# EAGLE schematic MJ838 - rev.1 - TCAN334 - poc (EAGLE 9.6.2)
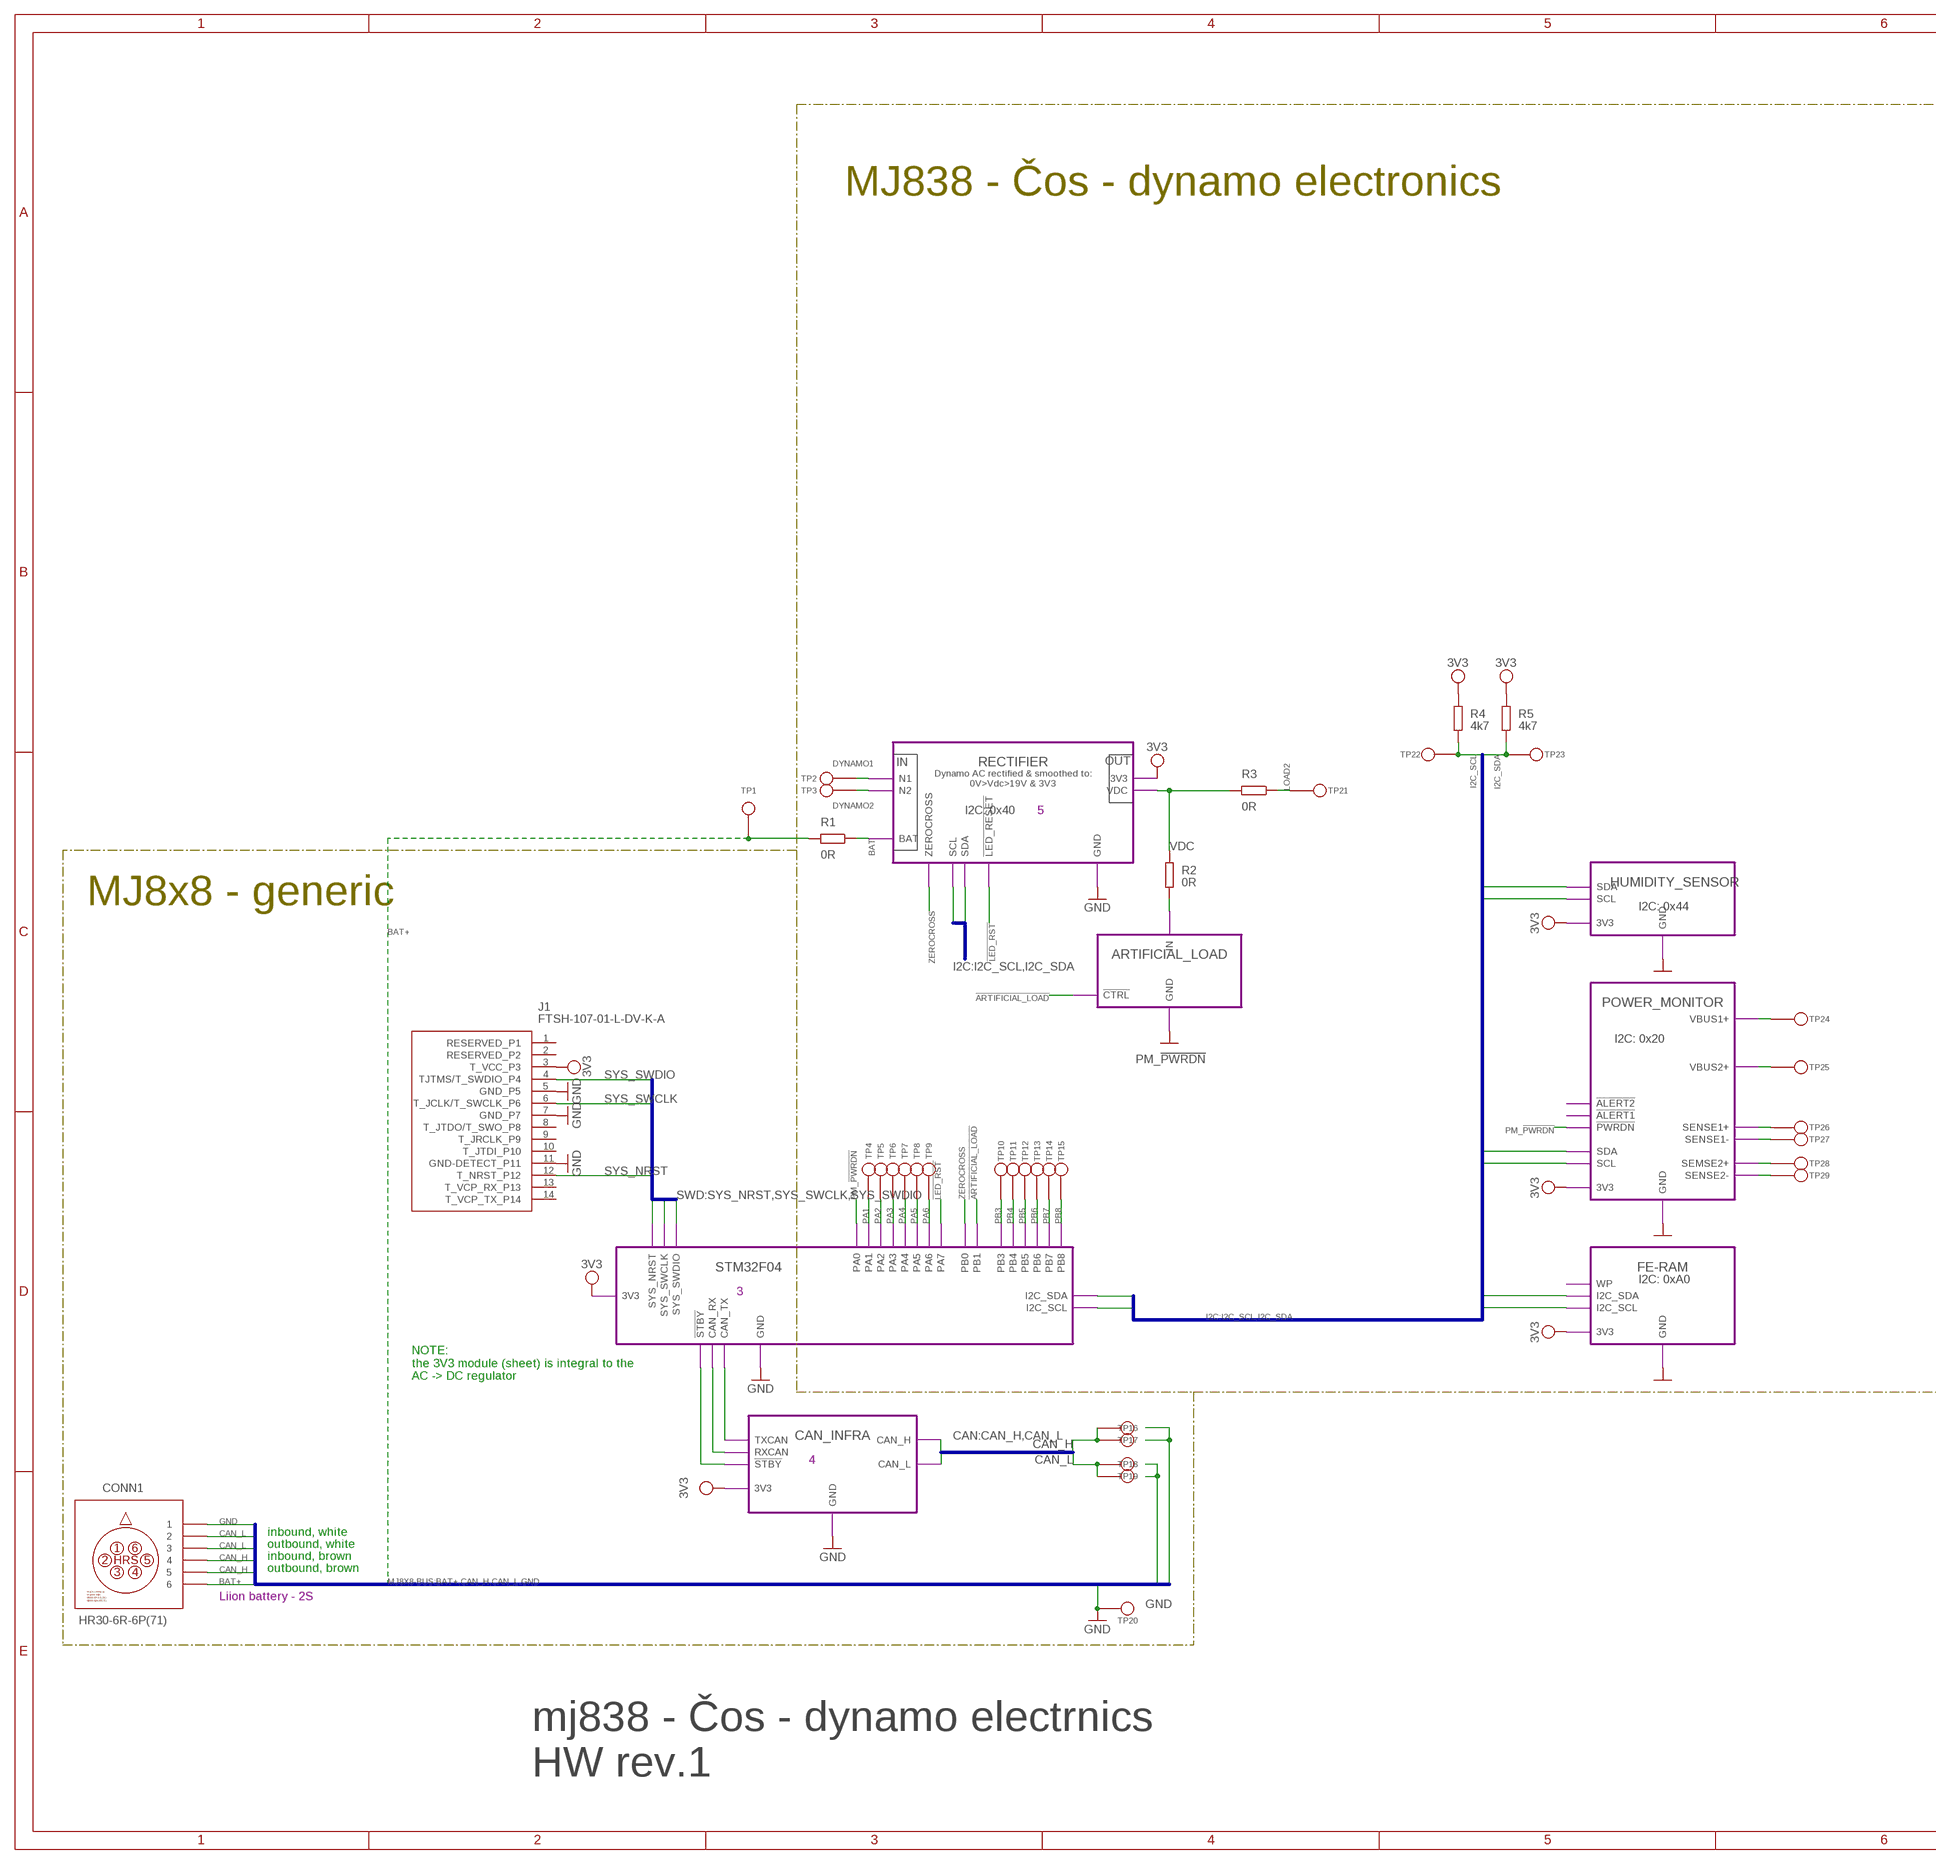
[diagram p0: schematic, sheet 1, part 1 of 2]
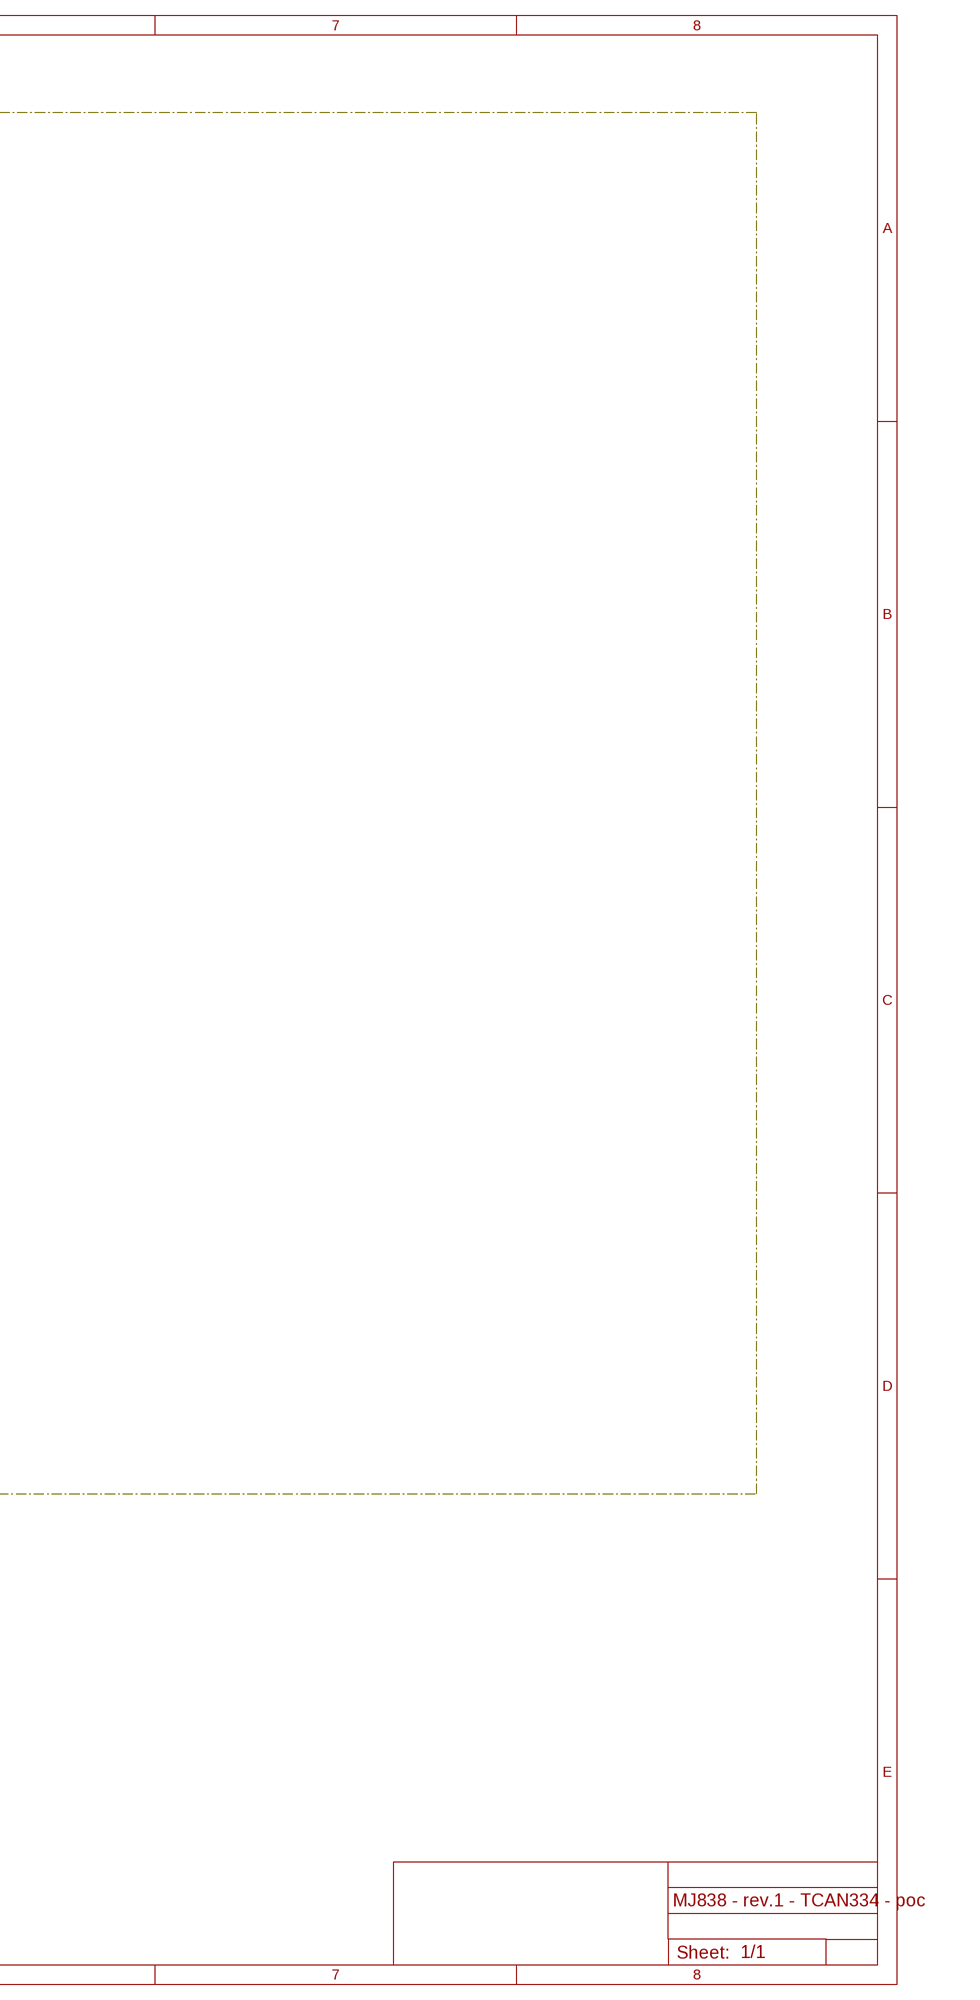
[diagram p1: schematic, sheet 1, part 2 of 2]

## Parts
CONN1  HR30-6R-6P(71)  HR-30-6R-6X  (no package)
J1  FTSH-107-01-L-DV-K-A  [FTSH10701LDVKA]
R1  0R  R-EU_R0805  [R0805]
R2  0R  R-EU_R0805  [R0805]
R3  0R  R-EU_R0805  [R0805]
R4  4k7  R-EU_R0402  [R0402]
R5  4k7  R-EU_R0402  [R0402]
TP1  BAT+  TPTH-0.9  [TH-0.9]
TP2  CAN high  TPTH-0.9  [TH-0.9]
TP3  CAN high  TPTH-0.9  [TH-0.9]
TP4  CAN high  TPTH-0.9  [TH-0.9]
TP5  CAN high  TPTH-0.9  [TH-0.9]
TP6  CAN high  TPTH-0.9  [TH-0.9]
TP7  CAN high  TPTH-0.9  [TH-0.9]
TP8  CAN high  TPTH-0.9  [TH-0.9]
TP9  CAN high  TPTH-0.9  [TH-0.9]
TP10  CAN high  TPTH-0.9  [TH-0.9]
TP11  CAN high  TPTH-0.9  [TH-0.9]
TP12  CAN high  TPTH-0.9  [TH-0.9]
TP13  CAN high  TPTH-0.9  [TH-0.9]
TP14  CAN high  TPTH-0.9  [TH-0.9]
TP15  CAN high  TPTH-0.9  [TH-0.9]
TP16  CAN high  TPTH-0.9  [TH-0.9]
TP17  CAN high  TPTH-0.9  [TH-0.9]
TP18  CAN low  TPTH-0.9  [TH-0.9]
TP19  CAN low  TPTH-0.9  [TH-0.9]
TP20  GND  TPTH-0.9  [TH-0.9]
TP21  CAN high  TPTH-0.9  [TH-0.9]
TP22  CAN high  TPTH-0.9  [TH-0.9]
TP23  CAN high  TPTH-0.9  [TH-0.9]
TP24  CAN high  TPTH-0.9  [TH-0.9]
TP25  CAN high  TPTH-0.9  [TH-0.9]
TP26  CAN high  TPTH-0.9  [TH-0.9]
TP27  CAN high  TPTH-0.9  [TH-0.9]
TP28  CAN high  TPTH-0.9  [TH-0.9]
TP29  CAN high  TPTH-0.9  [TH-0.9]

## Module instances
STM32F04 = STM32 (part numbers offset by 300)
CAN_INFRA = CAN_INFRA (part numbers offset by 400)
RECTIFIER = RECTIFIER (part numbers offset by 500)
ARTIFICIAL_LOAD = ARTIFICIAL_LOAD (part numbers offset by 800)
FE-RAM = FE-RAM (part numbers offset by 700)
POWER_MONITOR = POWER_MONITOR (part numbers offset by 600)
HUMIDITY_SENSOR = HUMIDITY (part numbers offset by 900)

## Nets
3V3 [3V3]: J1.3(T_VCC_P3) R4.2 R5.2 ; port STM32F04.3V3 CAN_INFRA.3V3 RECTIFIER.3V3 FE-RAM.3V3 POWER_MONITOR.3V3 HUMIDITY_SENSOR.3V3
!ARTIFICIAL_LOAD! [signal]: port ARTIFICIAL_LOAD.!CTRL! STM32F04.PB1
!LED_RST! [signal]: port RECTIFIER.!LED_RESET! STM32F04.PA7
!STBY! [signal]: port CAN_INFRA.!STBY! STM32F04.!STBY!
ART_LOAD_IN [VDC]: R2.2 ; port ARTIFICIAL_LOAD.IN
BAT [BAT+]: R1.1 ; port RECTIFIER.BAT
BAT+ [BAT+]: CONN1.6 R1.2 TP1.P$1(TP$1)
CAN_H [signal]: CONN1.4 CONN1.5 TP16.P$1(TP$1) TP17.P$1(TP$1) ; port CAN_INFRA.CAN_H
CAN_L [signal]: CONN1.2 CONN1.3 TP18.P$1(TP$1) TP19.P$1(TP$1) ; port CAN_INFRA.CAN_L
CAN_RX [signal]: port CAN_INFRA.RXCAN STM32F04.CAN_RX
CAN_TX [signal]: port CAN_INFRA.TXCAN STM32F04.CAN_TX
DYNAMO1 [VAC]: TP2.P$1(TP$1) ; port RECTIFIER.N1
DYNAMO2 [VAC]: TP3.P$1(TP$1) ; port RECTIFIER.N2
GND: CONN1.1 J1.5(GND_P5) J1.7(GND_P7) J1.11(GND-DETECT_P11) TP20.P$1(TP$1) ; port STM32F04.GND CAN_INFRA.GND RECTIFIER.GND ARTIFICIAL_LOAD.GND FE-RAM.GND POWER_MONITOR.GND HUMIDITY_SENSOR.GND
I2C_SCL [signal]: R4.1 TP22.P$1(TP$1) ; port FE-RAM.I2C_SCL STM32F04.I2C_SCL POWER_MONITOR.SCL HUMIDITY_SENSOR.SCL RECTIFIER.SCL
I2C_SDA [signal]: R5.1 TP23.P$1(TP$1) ; port FE-RAM.I2C_SDA STM32F04.I2C_SDA POWER_MONITOR.SDA HUMIDITY_SENSOR.SDA RECTIFIER.SDA
LOAD2 [VDC]: R3.1 TP21.P$1(TP$1)
PA1 [signal]: TP4.P$1(TP$1) ; port STM32F04.PA1
PA2 [signal]: TP5.P$1(TP$1) ; port STM32F04.PA2
PA3 [signal]: TP6.P$1(TP$1) ; port STM32F04.PA3
PA4 [signal]: TP7.P$1(TP$1) ; port STM32F04.PA4
PA5 [signal]: TP8.P$1(TP$1) ; port STM32F04.PA5
PA6 [signal]: TP9.P$1(TP$1) ; port STM32F04.PA6
PB3 [signal]: TP10.P$1(TP$1) ; port STM32F04.PB3
PB4 [signal]: TP11.P$1(TP$1) ; port STM32F04.PB4
PB5 [signal]: TP12.P$1(TP$1) ; port STM32F04.PB5
PB6 [signal]: TP13.P$1(TP$1) ; port STM32F04.PB6
PB7 [signal]: TP14.P$1(TP$1) ; port STM32F04.PB7
PB8 [signal]: TP15.P$1(TP$1) ; port STM32F04.PB8
PM_!PWRDN! [signal]: port STM32F04.PA0 POWER_MONITOR.!PWRDN!
SENSE1+ [VDC]: TP26.P$1(TP$1) ; port POWER_MONITOR.SENSE1+
SENSE1- [VDC]: TP27.P$1(TP$1) ; port POWER_MONITOR.SENSE1-
SENSE2+ [VDC]: TP28.P$1(TP$1) ; port POWER_MONITOR.SEMSE2+
SENSE2- [VDC]: TP29.P$1(TP$1) ; port POWER_MONITOR.SENSE2-
SYS_NRST [signal]: J1.12(T_NRST_P12) ; port STM32F04.SYS_NRST
SYS_SWCLK [signal]: J1.6(T_JCLK/T_SWCLK_P6) ; port STM32F04.SYS_SWCLK
SYS_SWDIO [signal]: J1.4(TJTMS/T_SWDIO_P4) ; port STM32F04.SYS_SWDIO
VBUS1+ [VDC]: TP24.P$1(TP$1) ; port POWER_MONITOR.VBUS1+
VBUS2+ [VDC]: TP25.P$1(TP$1) ; port POWER_MONITOR.VBUS2+
VDC [VDC]: R2.1 R3.2 ; port RECTIFIER.VDC
ZEROCROSS [signal]: port STM32F04.PB0 RECTIFIER.ZEROCROSS
Unconnected: J1.1(RESERVED_P1) J1.2(RESERVED_P2) J1.8(T_JTDO/T_SWO_P8) J1.9(T_JRCLK_P9) J1.10(T_JTDI_P10) J1.13(T_VCP_RX_P13) J1.14(T_VCP_TX_P14)

## Buses
CAN:CAN_H,CAN_L
SWD:SYS_NRST,SYS_SWCLK,SYS_SWDIO
MJ8X8-BUS:BAT+,CAN_H,CAN_L,GND
I2C:I2C_SCL,I2C_SDA

## Notes on the sheet
- MJ838 - Čos - dynamo electronics
- IN | OUT
- Dynamo AC rectified & smoothed to:
  0V>Vdc>19V & 3V3
- I2C: 0x40 | 5
- MJ8x8 - generic
- I2C: 0x44
- I2C: 0x20
- I2C: 0xA0
- 3
- NOTE:
  the 3V3 module (sheet) is integral to the
  AC -> DC regulator
- 4
- inbound, white
- outbound, white
- inbound, brown
- outbound, brown
- Liion battery - 2S
- mj838 - Čos - dynamo electrnics
  HW rev.1

## Library data of the parts
CONN1 = HR30-6R-6P - PushPull Receptacle:HR-30-6R-6X
J1 = STM32 JTAG 1.27mm 14pin header:FTSH-107-01-L-DV-K-A: Headers & Wire Housings .050" Micro Terminal Strip Source: Datasheet <https://componentsearchengine.com/Datasheets/1/FTSH-107-01-L-DV-K-A.pdf>; DESCRIPTION: Headers & Wire Housings .050" Micro Terminal Strip; HEIGHT: 5.97mm; MANUFACTURER_NAME: SAMTEC; MANUFACTURER_PART_NUMBER: FTSH-107-01-L-DV-K-A; MOUSER_PART_NUMBER: 200-FTSH10701LDVKA; MOUSER_PRICE-STOCK: https://www.mouser.com/Search/Refine.aspx?Keyword=200-FTSH10701LDVKA
R1-R5 = rcl:R-EU_: RESISTOR, European symbol; SPICEPREFIX: R
TP1-TP29 = signal testpoint:TP

## Module STM32
Ports: GND(pwr) 3V3(pwr) SYS_NRST(in) SYS_SWCLK(io) SYS_SWDIO(io) CAN_RX(in) CAN_TX(out) !STBY!(out) I2C_SCL(out) I2C_SDA(io) PB1(out) PB3(io) PB4(io) PB5(io) PB6(io) PB7(io) PB8(io) PB0(in) PA0(out) PA1(io) PA7(out) PA2(io) PA3(io) PA4(io) PA5(io) PA6(io)
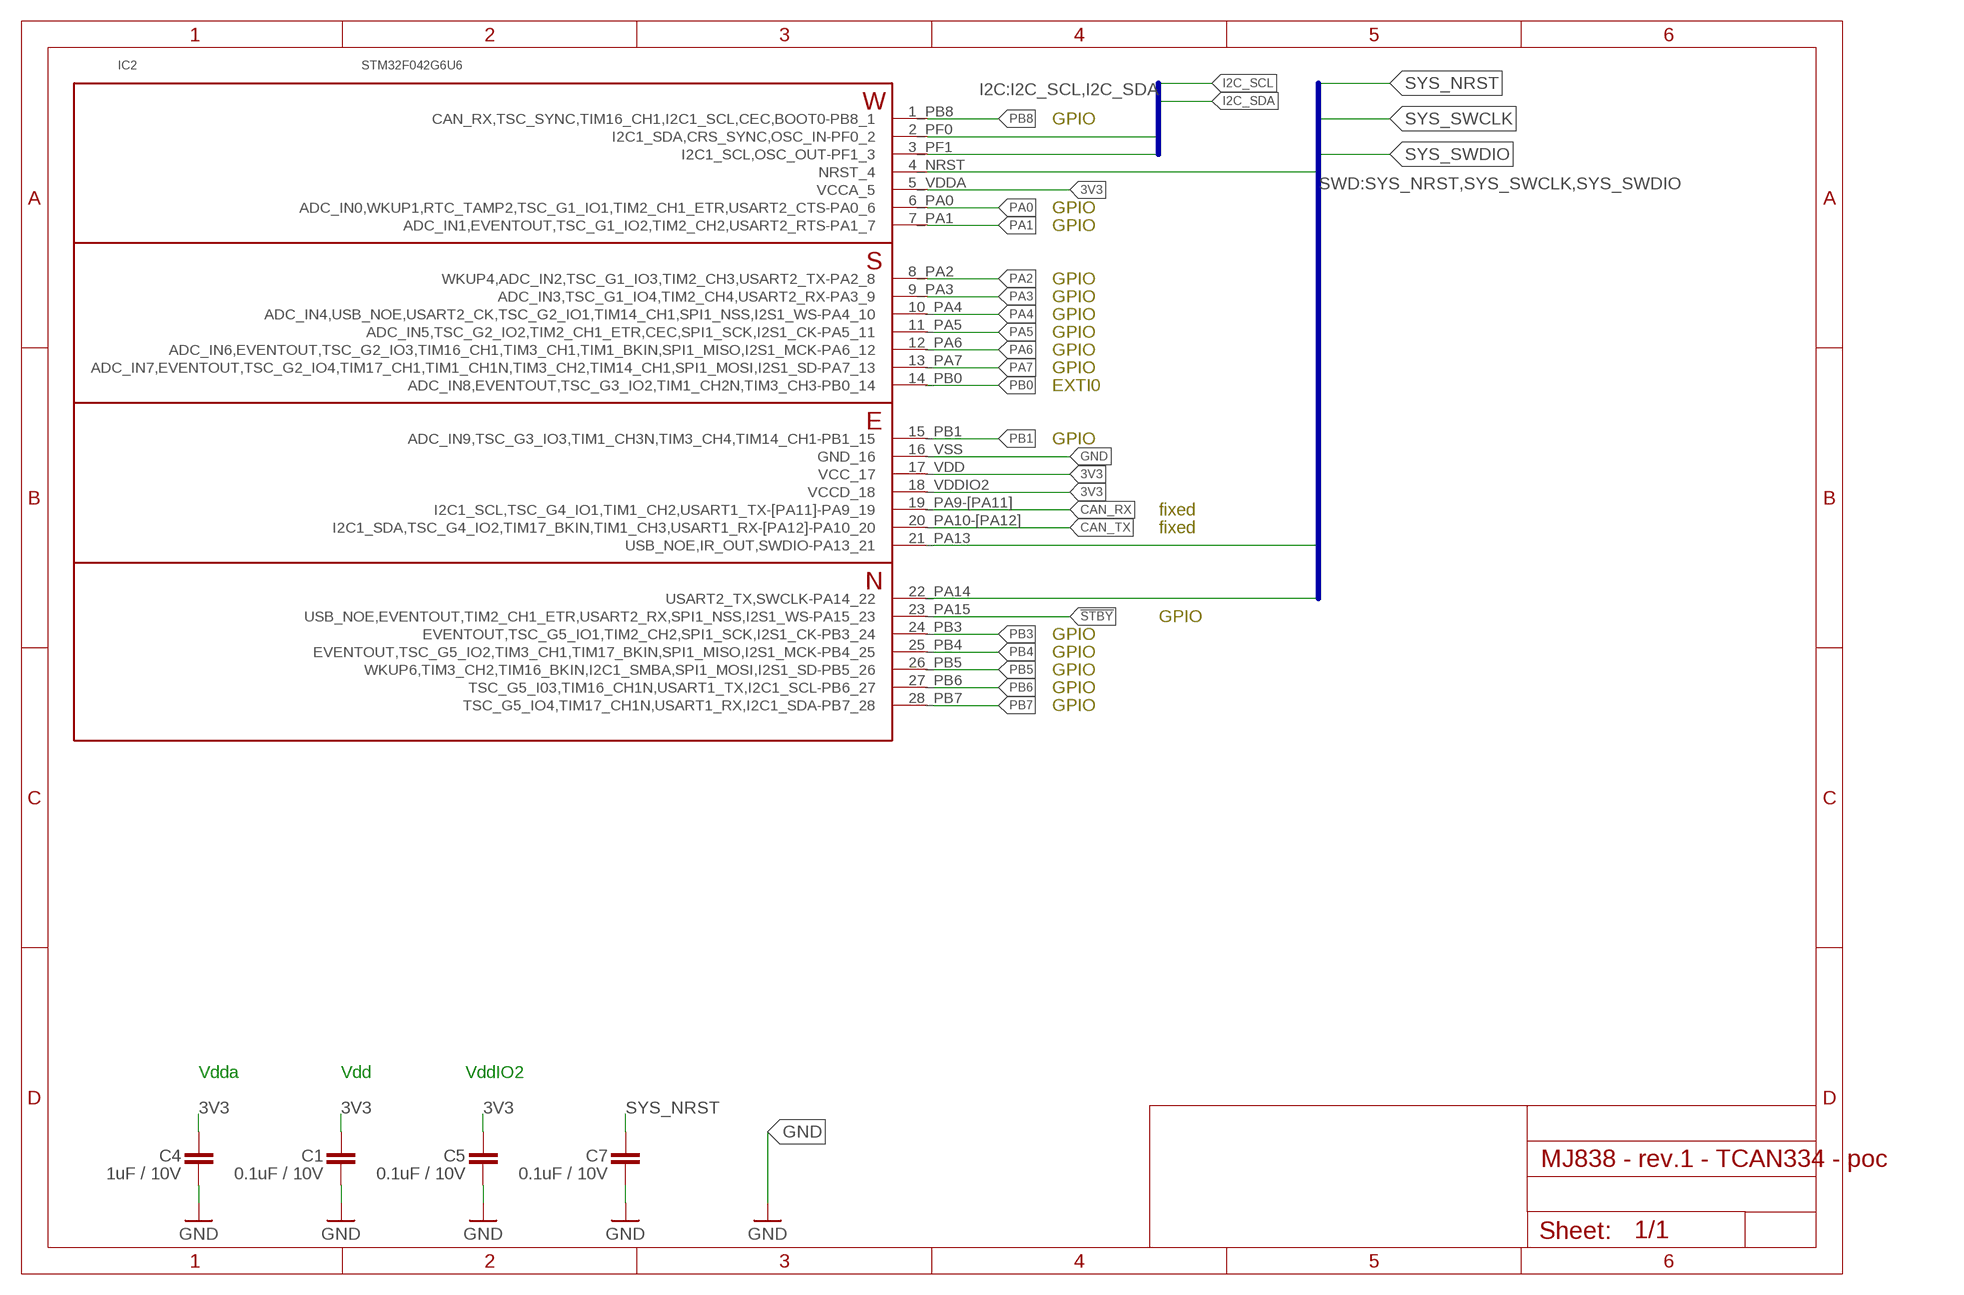
[diagram p2: schematic, module STM32, sheet 1]

### Parts
C1  0.1uF / 10V  C-EUC0402  [C0402]
C4  1uF / 10V  C-EUC0402  [C0402]
C5  0.1uF / 10V  C-EUC0402  [C0402]
C7  0.1uF / 10V  C-EUC0402  [C0402]
IC2  STM32F042G6U6  STM32F042G6  [UFQFPN-28]

### Nets
3V3 [3V3]: C1.2 C4.2 C5.2 IC2.5_VDDA(VCCA_5) IC2.17_VDD(VCC_17) IC2.18_VDDIO2(VCCD_18)
!STBY! [signal]: IC2.23_PA15(USB_NOE,EVENTOUT,TIM2_CH1_ETR,USART2_RX,SPI1_NSS,I2S1_WS-PA15_23)
CAN_RX [signal]: IC2.19_PA9-[PA11](I2C1_SCL,TSC_G4_IO1,TIM1_CH2,USART1_TX-[PA11]-PA9_19)
CAN_TX [signal]: IC2.20_PA10-[PA12](I2C1_SDA,TSC_G4_IO2,TIM17_BKIN,TIM1_CH3,USART1_RX-[PA12]-PA10_20)
GND: C1.1 C4.1 C5.1 C7.1 IC2.16_VSS(GND_16)
I2C_SCL [signal]: IC2.3_PF1(I2C1_SCL,OSC_OUT-PF1_3)
I2C_SDA [signal]: IC2.2_PF0(I2C1_SDA,CRS_SYNC,OSC_IN-PF0_2)
PA0 [signal]: IC2.6_PA0(ADC_IN0,WKUP1,RTC_TAMP2,TSC_G1_IO1,TIM2_CH1_ETR,USART2_CTS-PA0_6)
PA1 [signal]: IC2.7_PA1(ADC_IN1,EVENTOUT,TSC_G1_IO2,TIM2_CH2,USART2_RTS-PA1_7)
PA2 [signal]: IC2.8_PA2(WKUP4,ADC_IN2,TSC_G1_IO3,TIM2_CH3,USART2_TX-PA2_8)
PA3 [signal]: IC2.9_PA3(ADC_IN3,TSC_G1_IO4,TIM2_CH4,USART2_RX-PA3_9)
PA4 [signal]: IC2.10_PA4(ADC_IN4,USB_NOE,USART2_CK,TSC_G2_IO1,TIM14_CH1,SPI1_NSS,I2S1_WS-PA4_10)
PA5 [signal]: IC2.11_PA5(ADC_IN5,TSC_G2_IO2,TIM2_CH1_ETR,CEC,SPI1_SCK,I2S1_CK-PA5_11)
PA6 [signal]: IC2.12_PA6(ADC_IN6,EVENTOUT,TSC_G2_IO3,TIM16_CH1,TIM3_CH1,TIM1_BKIN,SPI1_MISO,I2S1_MCK-PA6_12)
PA7 [signal]: IC2.13_PA7(ADC_IN7,EVENTOUT,TSC_G2_IO4,TIM17_CH1,TIM1_CH1N,TIM3_CH2,TIM14_CH1,SPI1_MOSI,I2S1_SD-PA7_13)
PB0 [signal]: IC2.14_PB0(ADC_IN8,EVENTOUT,TSC_G3_IO2,TIM1_CH2N,TIM3_CH3-PB0_14)
PB1 [signal]: IC2.15_PB1(ADC_IN9,TSC_G3_IO3,TIM1_CH3N,TIM3_CH4,TIM14_CH1-PB1_15)
PB3 [signal]: IC2.24_PB3(EVENTOUT,TSC_G5_IO1,TIM2_CH2,SPI1_SCK,I2S1_CK-PB3_24)
PB4 [signal]: IC2.25_PB4(EVENTOUT,TSC_G5_IO2,TIM3_CH1,TIM17_BKIN,SPI1_MISO,I2S1_MCK-PB4_25)
PB5 [signal]: IC2.26_PB5(WKUP6,TIM3_CH2,TIM16_BKIN,I2C1_SMBA,SPI1_MOSI,I2S1_SD-PB5_26)
PB6 [signal]: IC2.27_PB6(TSC_G5_I03,TIM16_CH1N,USART1_TX,I2C1_SCL-PB6_27)
PB7 [signal]: IC2.28_PB7(TSC_G5_IO4,TIM17_CH1N,USART1_RX,I2C1_SDA-PB7_28)
PB8 [signal]: IC2.1_PB8(CAN_RX,TSC_SYNC,TIM16_CH1,I2C1_SCL,CEC,BOOT0-PB8_1)
SYS_NRST [signal]: C7.2 IC2.4_NRST(NRST_4)
SYS_SWCLK [signal]: IC2.22_PA14(USART2_TX,SWCLK-PA14_22)
SYS_SWDIO [signal]: IC2.21_PA13(USB_NOE,IR_OUT,SWDIO-PA13_21)

### Buses
SWD:SYS_NRST,SYS_SWCLK,SYS_SWDIO
I2C:I2C_SCL,I2C_SDA

### Notes on the sheet
- GPIO
- GPIO
- GPIO
- GPIO
- GPIO
- GPIO
- GPIO
- GPIO
- GPIO
- EXTI0
- GPIO
- fixed
- fixed
- GPIO
- GPIO
- GPIO
- GPIO
- GPIO
- GPIO
- Vdda | Vdd | VddIO2

### Library data of the parts
C1 C4 C5 C7 = rcl:C-EU: CAPACITOR, European symbol; SPICEPREFIX: C
IC2 = STM32F042G6:STM32F042G6

## Module CAN_INFRA
Ports: GND(pwr) 3V3(pwr) CAN_H(io) CAN_L(io) TXCAN(in) RXCAN(out) !STBY!(in)
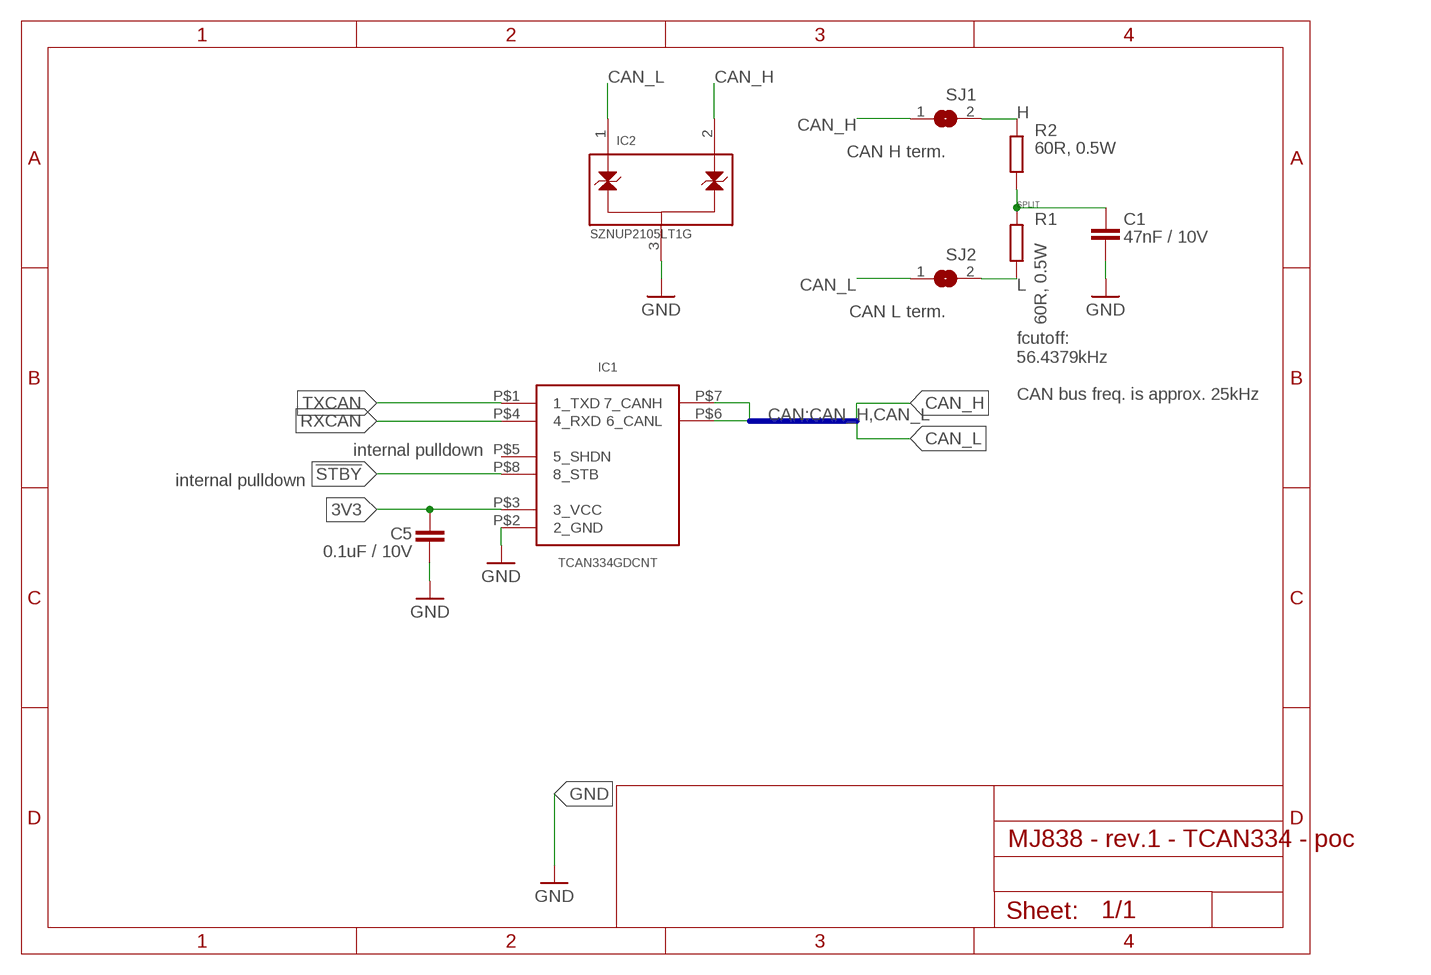
[diagram p3: schematic, module CAN_INFRA, sheet 1]

### Parts
C1  47nF / 10V  C-EUC0402  [C0402]
C5  0.1uF / 10V  C-EUC0402  [C0402]
IC1  TCAN334GDCNT  CAN33X  [SOT23-8]
IC2  SZNUP2105LT1G  NUP2105L  [SOT-23-3]
R1  60R, 0.5W  R-EU_R0805  [R0805]
R2  60R, 0.5W  R-EU_R0805  [R0805]
SJ1  CAN H term.  SJ  [SJ]
SJ2  CAN L term.  SJ  [SJ]

### Nets
3V3 [3V3]: C5.1 IC1.P$3(3_VCC)
!STBY! [signal]: IC1.P$8(8_STB)
CAN_H [signal]: IC1.P$7(7_CANH) IC2.2(PIN2) SJ1.1
CAN_L [signal]: IC1.P$6(6_CANL) IC2.1(PIN1) SJ2.1
GND: C1.2 C5.2 IC1.P$2(2_GND) IC2.3(PIN3)
H [signal]: R2.2 SJ1.2
L [signal]: R1.1 SJ2.2
RXCAN [signal]: IC1.P$4(4_RXD)
SPLIT [signal]: C1.1 R1.2 R2.1
TXCAN [signal]: IC1.P$1(1_TXD)
Unconnected: IC1.P$5(5_SHDN)

### Buses
CAN:CAN_H,CAN_L

### Notes on the sheet
- fcutoff:
  56.4379kHz
  
  CAN bus freq. is approx. 25kHz
- internal pulldown
- internal pulldown

### Library data of the parts
C1 C5 = rcl:C-EU: CAPACITOR, European symbol; SPICEPREFIX: C
IC1 = TCAN33x - 3.3V CAN Transciever:CAN33X
IC2 = NUP2105L - 27V ESD Protection Diode:NUP2105L
R1 R2 = rcl:R-EU_: RESISTOR, European symbol; SPICEPREFIX: R
SJ1 SJ2 = jumper:SJ: SMD solder JUMPER

## Module ZERO-CROSS_DETECTOR
Ports: GND(pwr) AC-IN(in) OUT(out) 3V3(pwr)
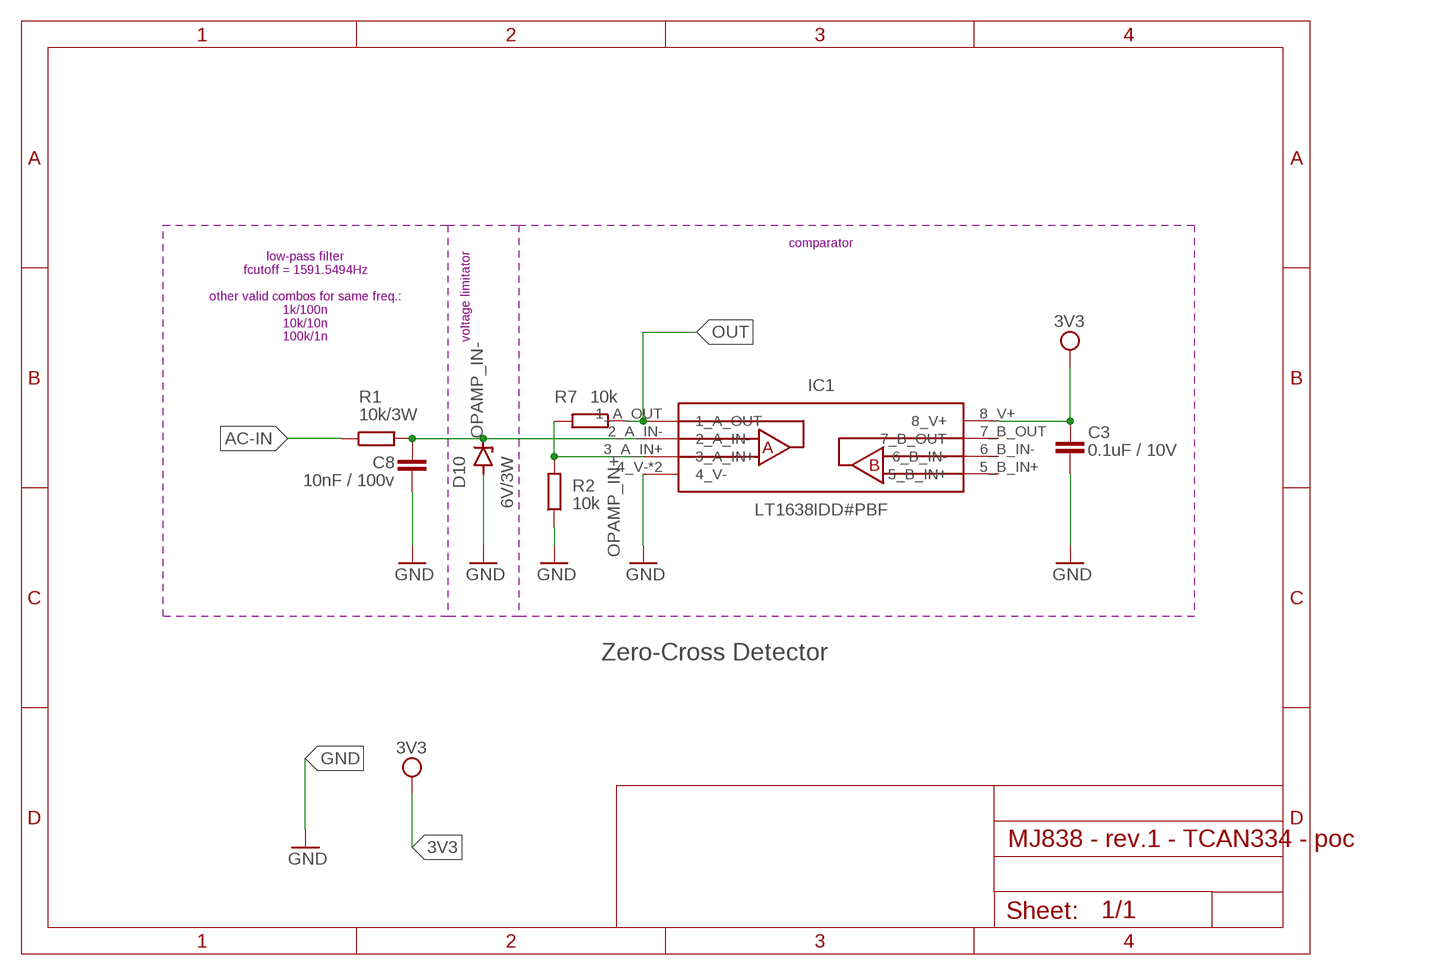
[diagram p4: schematic, module ZERO-CROSS_DETECTOR, sheet 1]

### Parts
C3  0.1uF / 10V  C-EUC0402  [C0402]
C8  10nF / 100v  C-EUC1812  [C1812]
D10  6V/3W  ZENER-DIODEDO214AA  [DO214AA]
IC1  LT1638IDD#PBF  LT1638  [DFN-8]
R1  10k/3W  R-EU_R2512  [R2512]
R2  10k  R-EU_R0402  [R0402]
R7  10k  R-EU_R0402  [R0402]

### Nets
3V3 [3V3]: C3.2 IC1.8_V+
AC-IN [VDynamo]: R1.1
GND: C3.1 C8.1 D10.A IC1.4_V- IC1.9_V-(4_V-) R2.1
OPAMP_IN+ [signal]: IC1.3_A_IN+ R2.2 R7.2
OPAMP_IN- [VDynamo]: C8.2 D10.C IC1.2_A_IN- R1.2
OUT [signal]: IC1.1_A_OUT R7.1
Unconnected: IC1.5_B_IN+ IC1.6_B_IN- IC1.7_B_OUT

### Notes on the sheet
- comparator
- low-pass filter
  fcutoff = 1591.5494Hz
  
  other valid combos for same freq.:
  1k/100n
  10k/10n
  100k/1n
- voltage limitator
- Zero-Cross Detector

### Library data of the parts
C3 C8 = rcl:C-EU: CAPACITOR, European symbol; SPICEPREFIX: C
D10 = diode:ZENER-DIODE: Z-Diode
IC1 = LT1638 - Rail to Rail OpAmp:LT1638
R1 R2 R7 = rcl:R-EU_: RESISTOR, European symbol; SPICEPREFIX: R

## Module 3V3
Ports: GND(pwr) VIN(pwr) 3V3(pwr)
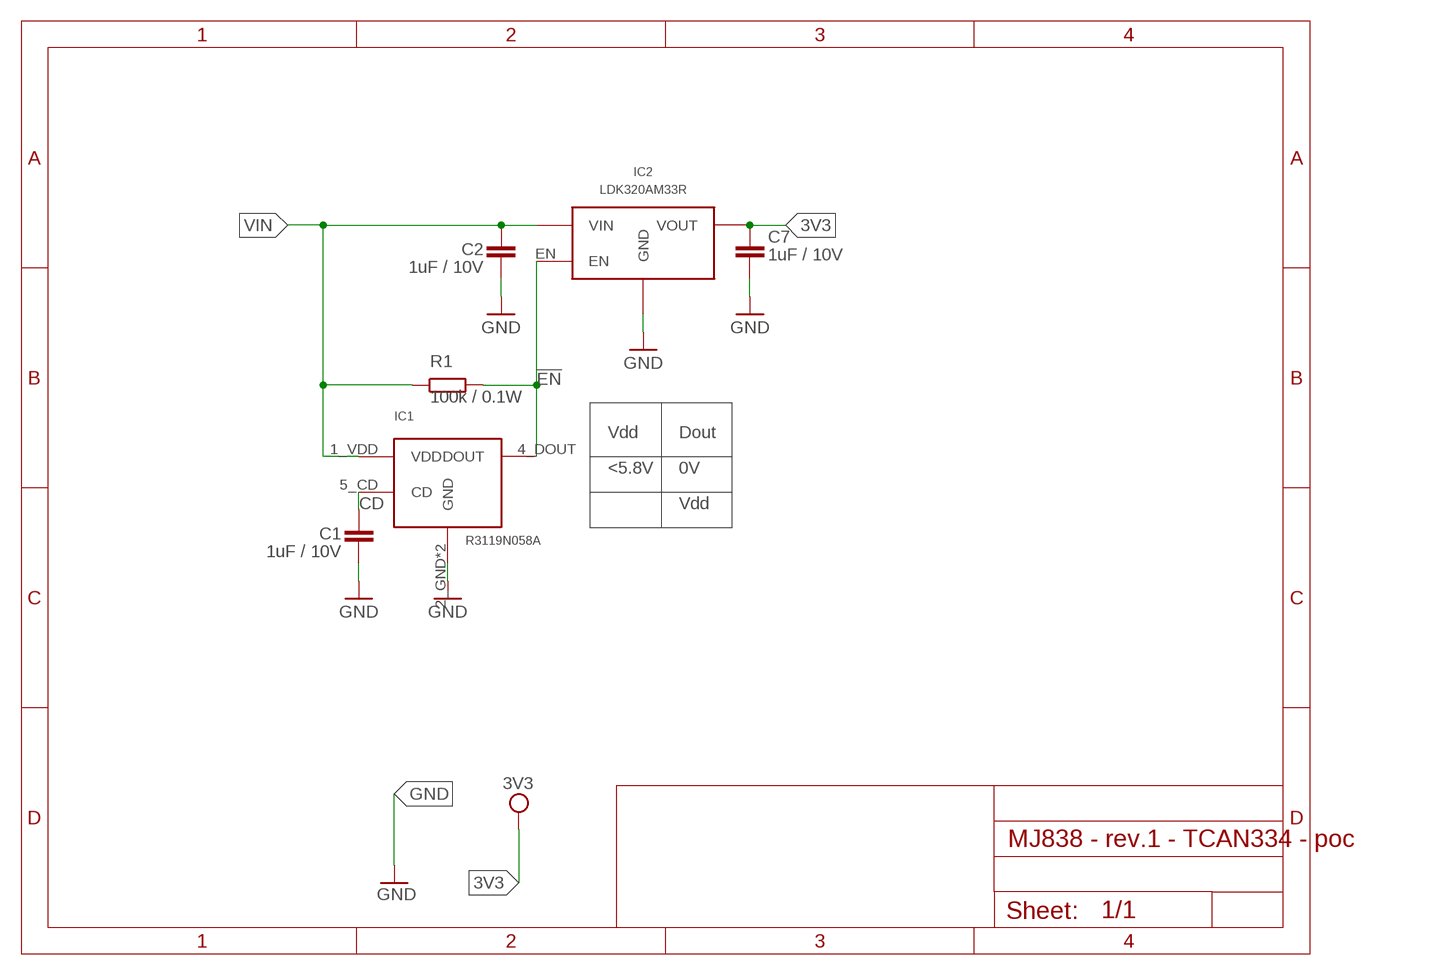
[diagram p5: schematic, module 3V3, sheet 1]

### Parts
C1  1uF / 10V  C-EUC0402  [C0402]
C2  1uF / 10V  C-EUC0402  [C0402]
C7  1uF / 10V  C-EUC0402  [C0402]
IC1  R3119N058A  R3119XXXA  [SOT23-5]
IC2  LDK320AM33R  LDK320SOT-23-5L  [SOT-23-5L]
R1  100k / 0.1W  R-EU_R0402  [R0402]

### Nets
3V3 [3V3]: C7.2 IC2.OUT(VOUT)
!EN! [VDC]: IC1.4_DOUT(DOUT) IC2.EN R1.2
CD [3V3]: C1.1 IC1.5_CD(CD)
GND: C1.2 C2.2 C7.1 IC1.2_GND(GND) IC1.3_GND(GND) IC2.GND
VIN [VDC]: C2.1 IC1.1_VDD(VDD) IC2.IN(VIN) R1.1

### Notes on the sheet
- Vdd | Dout
- <5.8V | 0V
- Vdd

### Library data of the parts
C1 C2 C7 = rcl:C-EU: CAPACITOR, European symbol; SPICEPREFIX: C
IC1 = R3119x - Input Voltage Detector:R3119XXXA
IC2 = LDK320 5V LDO:LDK320
R1 = rcl:R-EU_: RESISTOR, European symbol; SPICEPREFIX: R

## Module SMOOTHING_CAP
Ports: GND(pwr) VIN(pwr) VOUT(pwr)
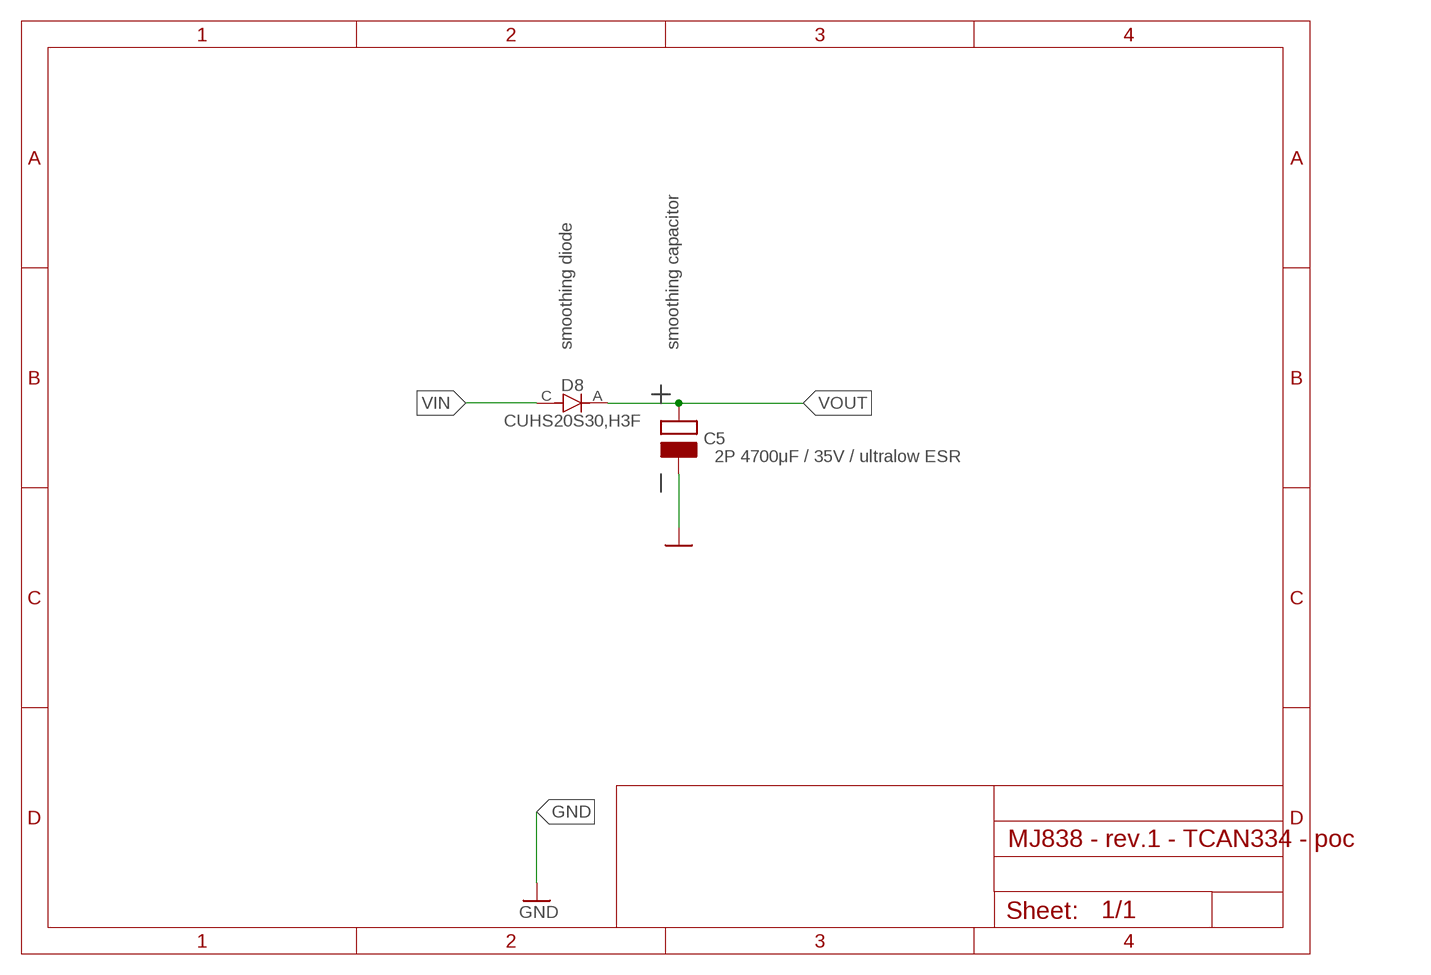
[diagram p6: schematic, module SMOOTHING_CAP, sheet 1]

### Parts
C5  2P 4700μF / 35V / ultralow ESR  C-POL  [TH]
D8  CUHS20S30,H3F  CUHS20S30  [US2H]

### Nets
GND: C5.NEG
VIN [VAC]: D8.C
VOUT [VDC]: C5.POS D8.A

### Notes on the sheet
- smoothing diode | smoothing capacitor

### Library data of the parts
C5 = C-Pol:C-POL
D8 = CUHS20S30 - Schottky Barrier Diode:CUHS20S30

## Module SSR_NC/NO
Ports: SSR_ANODE(pwr) SW1_IN(hiz) SW2_IN(hiz) SW1_OUT(hiz) SW2_OUT(hiz) SW1_CAT(in) SW2_CAT(in)
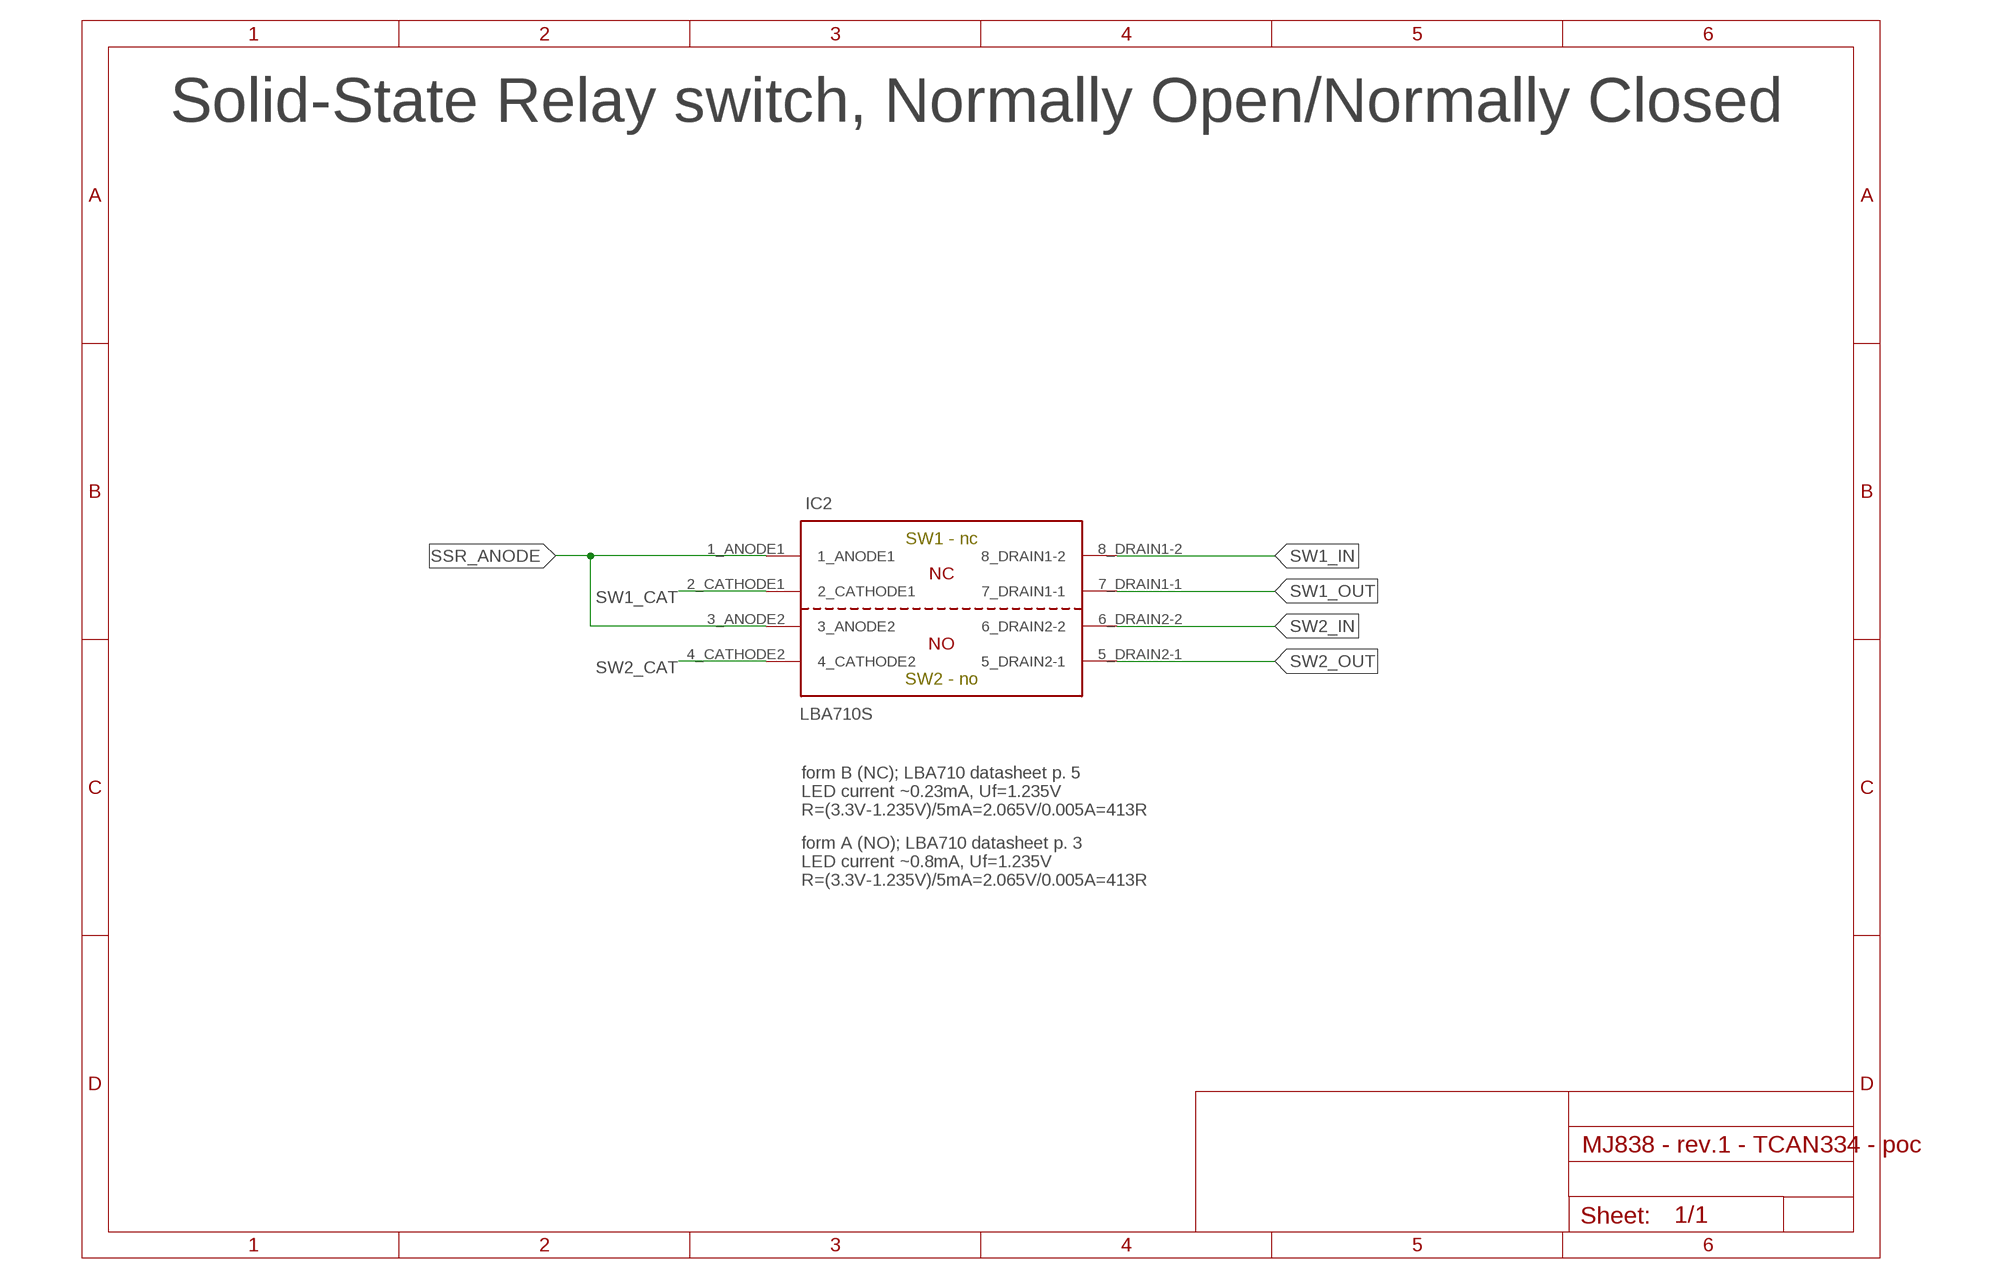
[diagram p7: schematic, module SSR_NC/NO, sheet 1]

### Parts
IC2  LBA710S  LBA710  [SMD_DIP8]

### Nets
SSR_ANODE [3V3]: IC2.1_ANODE1 IC2.3_ANODE2
SW1_CAT [3V3]: IC2.2_CATHODE1
SW1_IN [BAT+]: IC2.8_DRAIN1-2
SW1_OUT [BAT+]: IC2.7_DRAIN1-1
SW2_CAT [3V3]: IC2.4_CATHODE2
SW2_IN [BAT+]: IC2.6_DRAIN2-2
SW2_OUT [BAT+]: IC2.5_DRAIN2-1

### Notes on the sheet
- Solid-State Relay switch, Normally Open/Normally Closed
- SW1 - nc
- SW2 - no
- form B (NC); LBA710 datasheet p. 5
  LED current ~0.23mA, Uf=1.235V
  R=(3.3V-1.235V)/5mA=2.065V/0.005A=413R
- form A (NO); LBA710 datasheet p. 3
  LED current ~0.8mA, Uf=1.235V
  R=(3.3V-1.235V)/5mA=2.065V/0.005A=413R

### Library data of the parts
IC2 = LxA710 - Solid State Relay Form A-AB:LBA710

## Module SSR_NO/NO
Ports: SSR_ANODE(pwr) SW1_IN(hiz) SW1_OUT(hiz) SW2_IN(hiz) SW2_OUT(hiz) SW1_CAT(in) SW2_CAT(in)
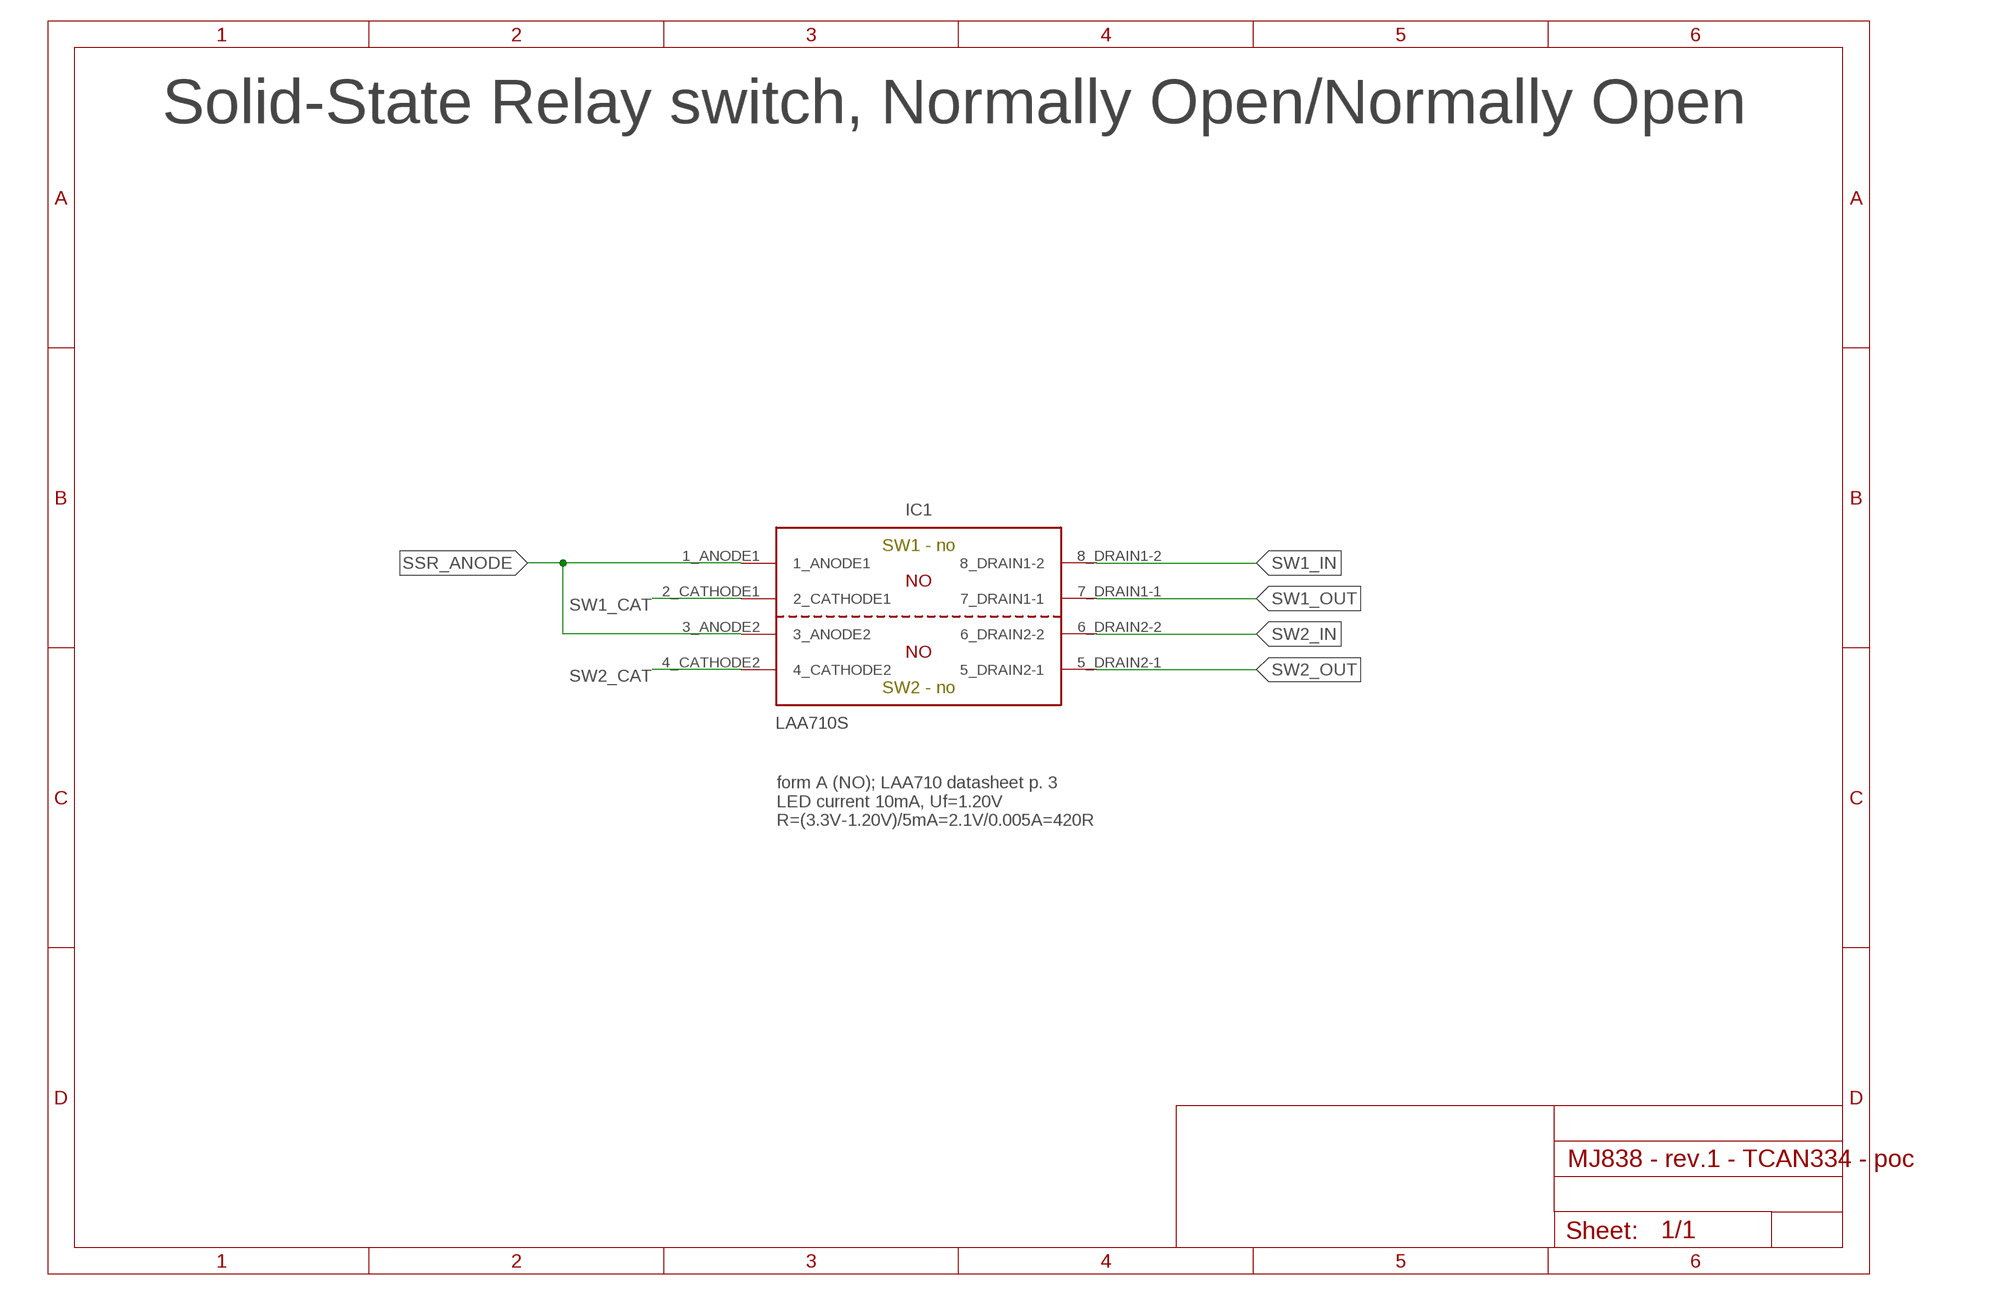
[diagram p8: schematic, module SSR_NO/NO, sheet 1]

### Parts
IC1  LAA710S  LAA710  [SMD_DIP8]

### Nets
SSR_ANODE [3V3]: IC1.1_ANODE1 IC1.3_ANODE2
SW1_CAT [3V3]: IC1.2_CATHODE1
SW1_IN [BAT+]: IC1.8_DRAIN1-2
SW1_OUT [BAT+]: IC1.7_DRAIN1-1
SW2_CAT [3V3]: IC1.4_CATHODE2
SW2_IN [BAT+]: IC1.6_DRAIN2-2
SW2_OUT [BAT+]: IC1.5_DRAIN2-1

### Notes on the sheet
- Solid-State Relay switch, Normally Open/Normally Open
- SW1 - no
- SW2 - no
- form A (NO); LAA710 datasheet p. 3
  LED current 10mA, Uf=1.20V
  R=(3.3V-1.20V)/5mA=2.1V/0.005A=420R

### Library data of the parts
IC1 = LxA710 - Solid State Relay Form A-AB:LAA710

## Module OVP
Ports: N1(pwr) N2(pwr)
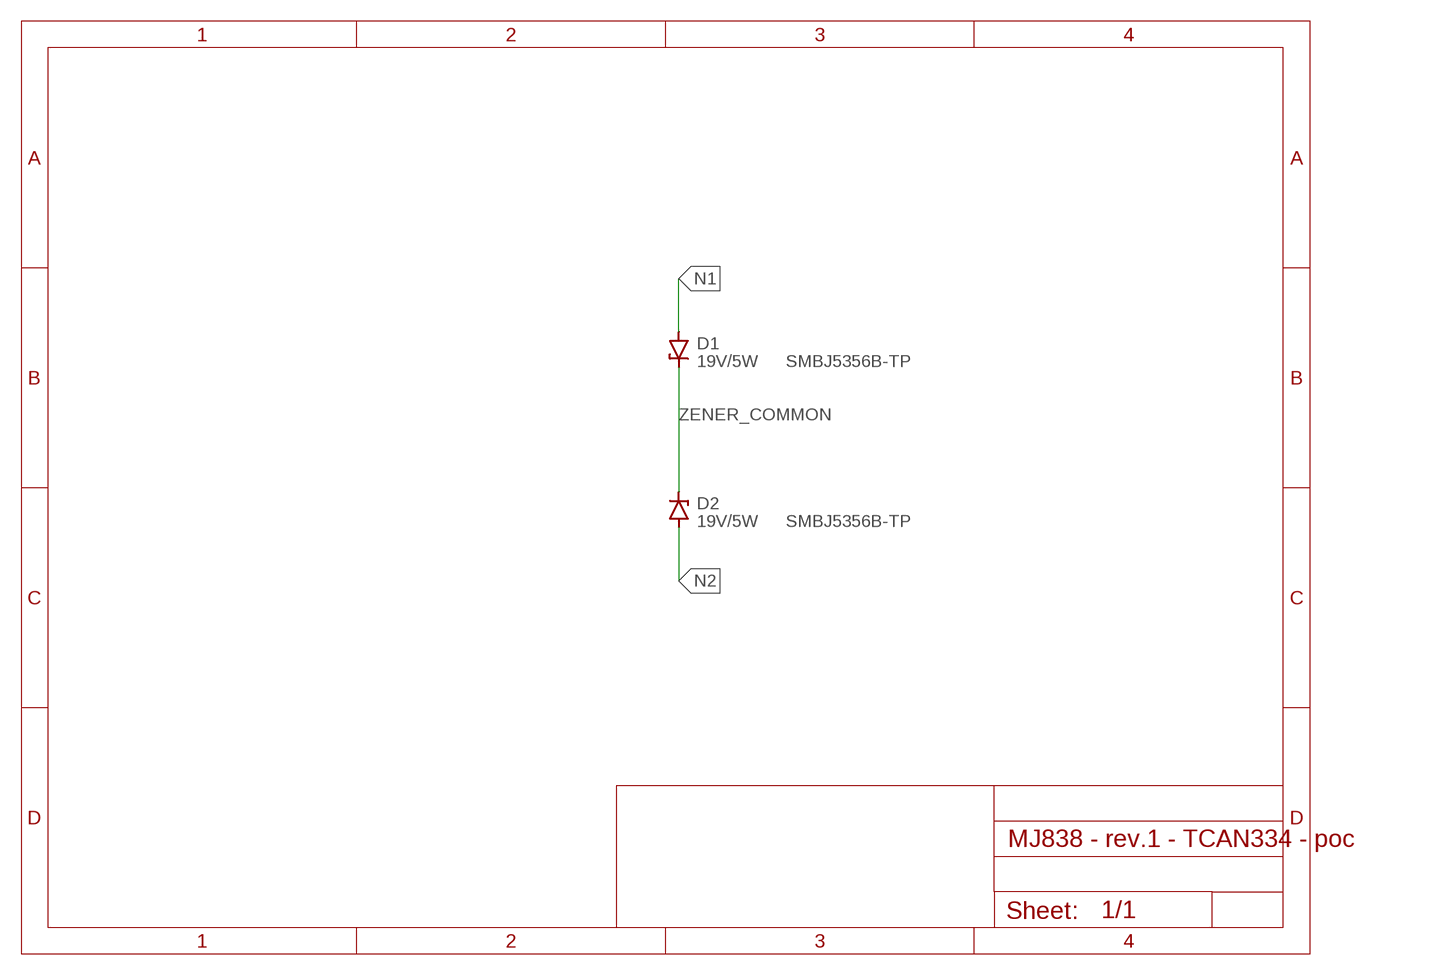
[diagram p9: schematic, module OVP, sheet 1]

### Parts
D1  19V/5W  ZENER-DIODEDO214AA  [DO214AA]
D2  19V/5W  ZENER-DIODEDO214AA  [DO214AA]

### Nets
N1 [VDynamo]: D1.A
N2 [VDynamo]: D2.A
ZENER_COMMON [VDynamo]: D1.C D2.C

### Notes on the sheet
- SMBJ5356B-TP
- SMBJ5356B-TP

### Library data of the parts
D1 D2 = diode:ZENER-DIODE: Z-Diode

## Module DELON
Ports: GND(pwr) SSR_ANODE(pwr) VRECT(pwr) DELON_IN(pwr) !SW_CD!(in)
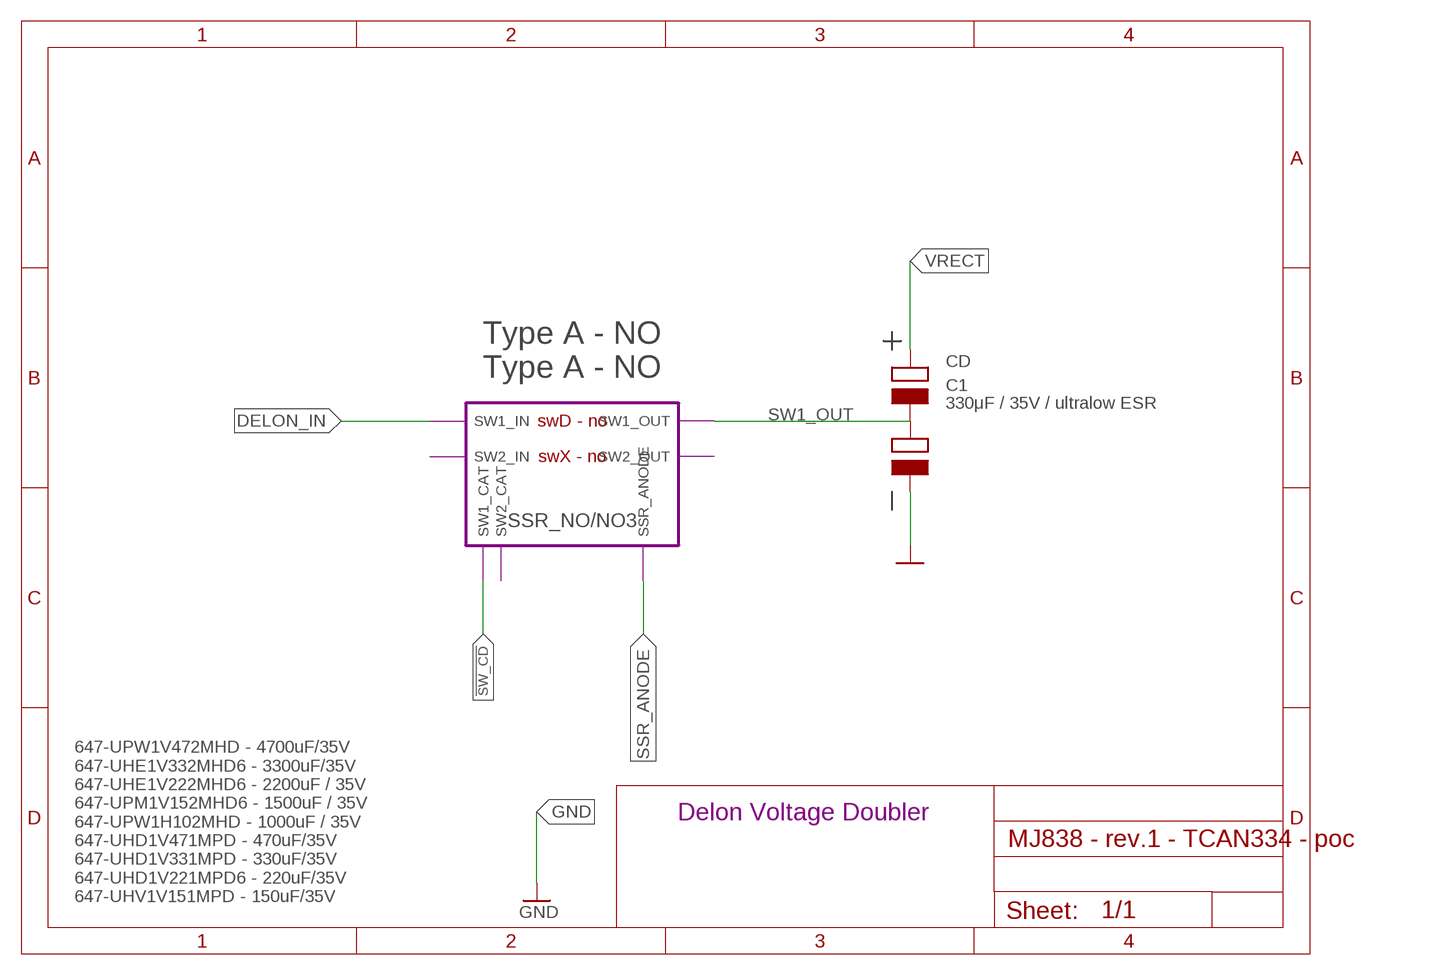
[diagram p10: schematic, module DELON, sheet 1]

### Parts
C1  330μF / 35V / ultralow ESR  C-POL-2S  [TH-2S]

### Module instances
SSR_NO/NO3 = SSR_NO/NO

### Nets
!SW_CD! [signal]: port SSR_NO/NO3.SW1_CAT
DELON_IN [VAC]: port SSR_NO/NO3.SW1_IN
GND: C1.3_NEG(NEG)
SSR_ANODE [3V3]: port SSR_NO/NO3.SSR_ANODE
SW1_OUT [VAC]: C1.2_MID(MID) ; port SSR_NO/NO3.SW1_OUT
VRECT [VAC]: C1.1_POS(POS)

### Notes on the sheet
- Type A - NO
  Type A - NO
- CD
- swD - no
- swX - no
- 647-UPW1V472MHD - 4700uF/35V
  647-UHE1V332MHD6 - 3300uF/35V
  647-UHE1V222MHD6 - 2200uF / 35V
  647-UPM1V152MHD6 - 1500uF / 35V
  647-UPW1H102MHD - 1000uF / 35V
  647-UHD1V471MPD - 470uF/35V
  647-UHD1V331MPD - 330uF/35V
  647-UHD1V221MPD6 - 220uF/35V
  647-UHV1V151MPD - 150uF/35V
- Delon Voltage Doubler

### Library data of the parts
C1 = C-Pol:C-POL-2S

## Module TUNING_CAPS
Ports: SSR_ANODE(pwr) VRECT(pwr) N1(pwr) L1(pwr) L2(pwr) !SW1!(in) !SW2!(in) !SW_CA!(in) !SW_CB!(in) !SW_CC!(in)
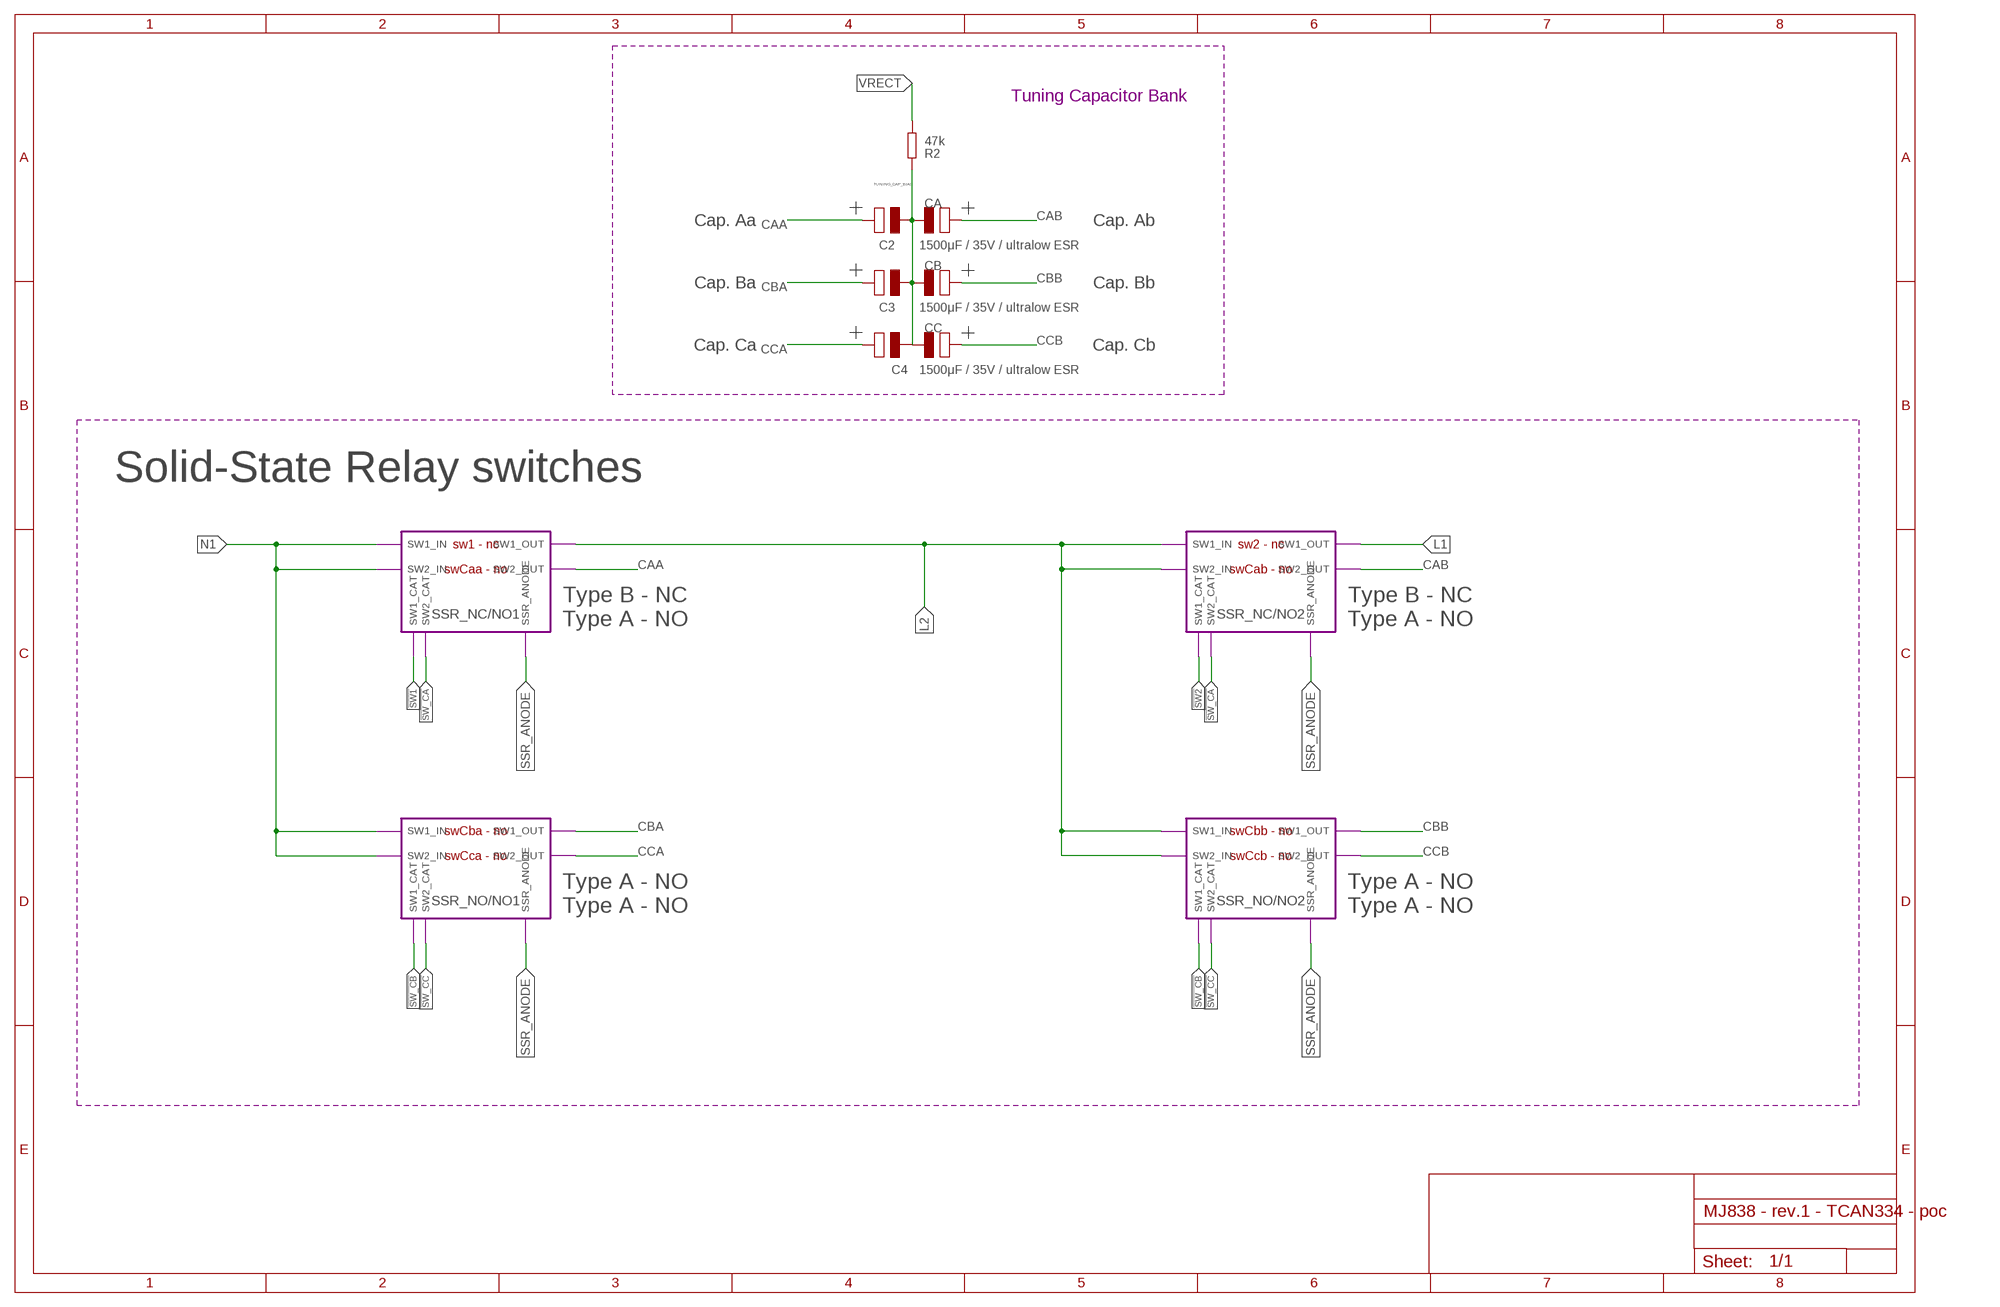
[diagram p11: schematic, module TUNING_CAPS, sheet 1]

### Parts
C2  1500μF / 35V / ultralow ESR  C-POL-2S-BACK-TO-BACK  [TH-2S-BACK-TO-BACK]
C3  1500μF / 35V / ultralow ESR  C-POL-2S-BACK-TO-BACK  [TH-2S-BACK-TO-BACK]
C4  1500μF / 35V / ultralow ESR  C-POL-2S-BACK-TO-BACK  [TH-2S-BACK-TO-BACK]
R2  47k  R-EU_R0805  [R0805]

### Module instances
SSR_NC/NO1 = SSR_NC/NO
SSR_NC/NO2 = SSR_NC/NO
SSR_NO/NO1 = SSR_NO/NO
SSR_NO/NO2 = SSR_NO/NO

### Nets
!SW1! [signal]: port SSR_NC/NO1.SW1_CAT
!SW2! [signal]: port SSR_NC/NO2.SW1_CAT
!SW_CA! [signal]: port SSR_NC/NO1.SW2_CAT SSR_NC/NO2.SW2_CAT
!SW_CB! [signal]: port SSR_NO/NO2.SW1_CAT SSR_NO/NO1.SW1_CAT
!SW_CC! [signal]: port SSR_NO/NO2.SW2_CAT SSR_NO/NO1.SW2_CAT
CAA [VAC]: C2.1_C ; port SSR_NC/NO1.SW2_OUT
CAB [VAC]: C2.3_C(2_C) ; port SSR_NC/NO2.SW2_OUT
CBA [VAC]: C3.1_C ; port SSR_NO/NO1.SW1_OUT
CBB [VAC]: C3.3_C(2_C) ; port SSR_NO/NO2.SW1_OUT
CCA [VAC]: C4.1_C ; port SSR_NO/NO1.SW2_OUT
CCB [VAC]: C4.3_C(2_C) ; port SSR_NO/NO2.SW2_OUT
L1 [VAC]: port SSR_NC/NO2.SW1_OUT
L2 [VAC]: port SSR_NC/NO1.SW1_OUT SSR_NC/NO2.SW1_IN SSR_NC/NO2.SW2_IN SSR_NO/NO2.SW1_IN SSR_NO/NO2.SW2_IN
N1 [VDynamo]: port SSR_NC/NO1.SW1_IN SSR_NC/NO1.SW2_IN SSR_NO/NO1.SW1_IN SSR_NO/NO1.SW2_IN
SSR_ANODE [3V3]: port SSR_NC/NO1.SSR_ANODE SSR_NC/NO2.SSR_ANODE SSR_NO/NO1.SSR_ANODE SSR_NO/NO2.SSR_ANODE
TUNING_CAP_BIAS [VAC]: C2.2_MID(MID) C3.2_MID(MID) C4.2_MID(MID) R2.1
VRECT [VAC]: R2.2

### Notes on the sheet
- Tuning Capacitor Bank
- CA
- Cap. Aa | Cap. Ab
- CB
- Cap. Ba | Cap. Bb
- CC
- Cap. Ca | Cap. Cb
- Solid-State Relay switches
- sw1 - nc | sw2 - nc
- swCaa - no | swCab - no
- Type B - NC
  Type A - NO
- Type B - NC
  Type A - NO
- swCba - no | swCbb - no
- swCca - no | swCcb - no
- Type A - NO
  Type A - NO
- Type A - NO
  Type A - NO

### Library data of the parts
C2-C4 = C-Pol:C-POL-2S-BACK-TO-BACK
R2 = rcl:R-EU_: RESISTOR, European symbol; SPICEPREFIX: R

## Module GRAETZ+DELON
Ports: N1(pwr) N2(pwr) GND(pwr) VRECT(pwr) 3V3(pwr) SCL(in) SDA(io) !RESET!(in)
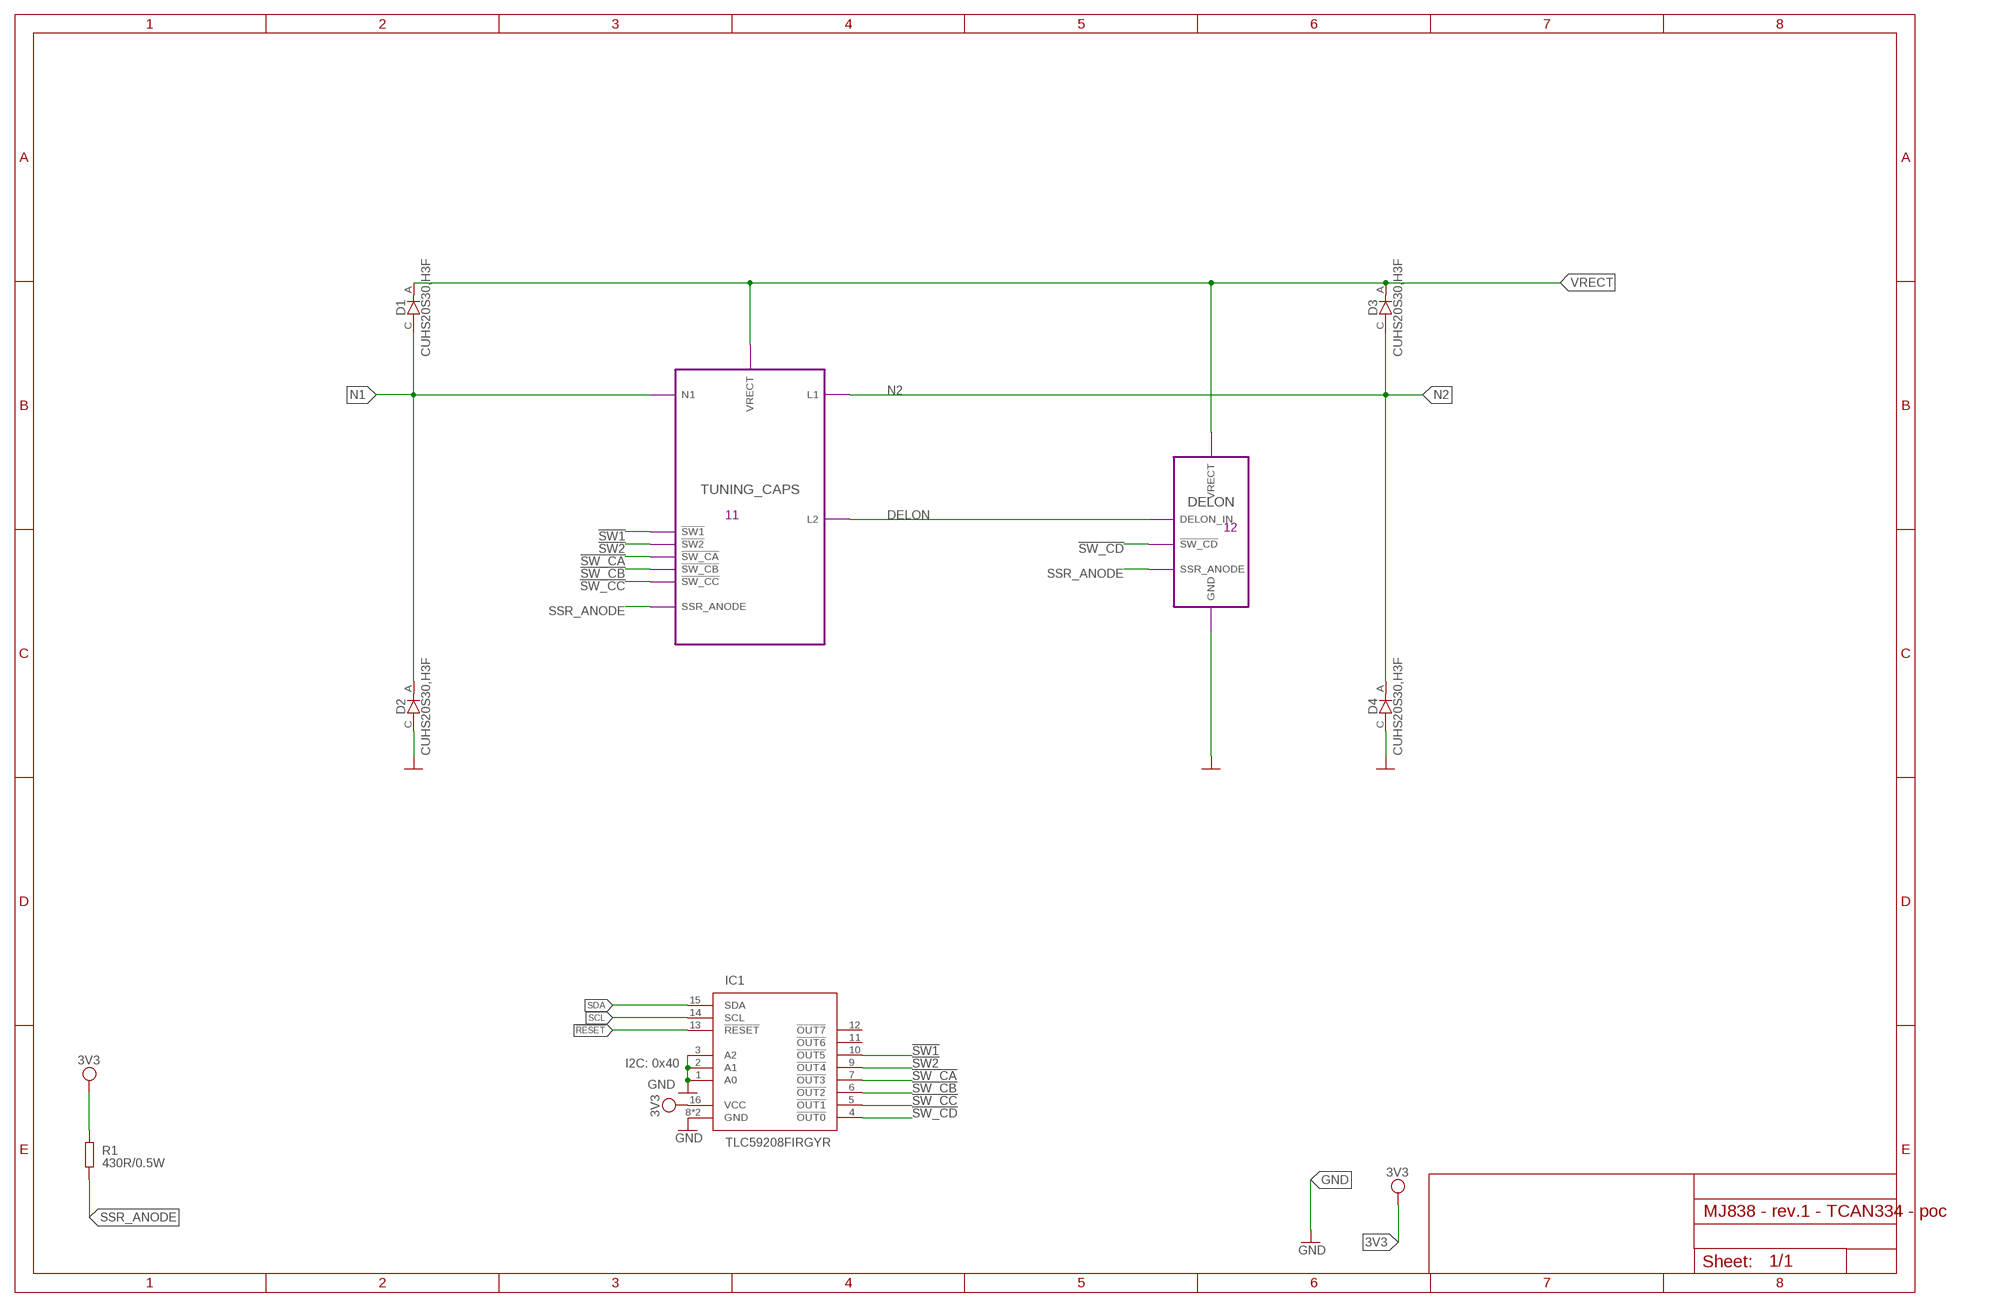
[diagram p12: schematic, module GRAETZ+DELON, sheet 1]

### Parts
D1  CUHS20S30,H3F  CUHS20S30  [US2H]
D2  CUHS20S30,H3F  CUHS20S30  [US2H]
D3  CUHS20S30,H3F  CUHS20S30  [US2H]
D4  CUHS20S30,H3F  CUHS20S30  [US2H]
IC1  TLC59208FIRGYR  TLC59208F  [VQFN16]
R1  430R/0.5W  R-EU_R0805  [R0805]

### Module instances
DELON = DELON
TUNING_CAPS = TUNING_CAPS

### Nets
3V3 [VDC]: IC1.16(VCC) R1.2
!RESET! [signal]: IC1.13(!RESET!)
!SW1! [3V3]: IC1.10(!OUT5!) ; port TUNING_CAPS.!SW1!
!SW2! [3V3]: IC1.9(!OUT4!) ; port TUNING_CAPS.!SW2!
!SW_CA! [3V3]: IC1.7(!OUT3!) ; port TUNING_CAPS.!SW_CA!
!SW_CB! [3V3]: IC1.6(!OUT2!) ; port TUNING_CAPS.!SW_CB!
!SW_CC! [3V3]: IC1.5(!OUT1!) ; port TUNING_CAPS.!SW_CC!
!SW_CD! [3V3]: IC1.4(!OUT0!) ; port DELON.!SW_CD!
DELON [VAC]: port TUNING_CAPS.L2 DELON.DELON_IN
GND: D2.C D4.C IC1.1(A0) IC1.2(A1) IC1.3(A2) IC1.8(GND) IC1.17(GND) ; port DELON.GND
N1 [VDynamo]: D1.C D2.A ; port TUNING_CAPS.N1
N2 [VDynamo]: D3.C D4.A ; port TUNING_CAPS.L1
SCL [signal]: IC1.14(SCL)
SDA [signal]: IC1.15(SDA)
SSR_ANODE [3V3]: R1.1 ; port DELON.SSR_ANODE TUNING_CAPS.SSR_ANODE
VRECT [VAC]: D1.A D3.A ; port TUNING_CAPS.VRECT DELON.VRECT
Unconnected: IC1.11(!OUT6!) IC1.12(!OUT7!)

### Notes on the sheet
- 11
- 12
- I2C: 0x40

### Library data of the parts
D1-D4 = CUHS20S30 - Schottky Barrier Diode:CUHS20S30
IC1 = TLC59208F - LED Driver:TLC59208F
R1 = rcl:R-EU_: RESISTOR, European symbol; SPICEPREFIX: R

## Module RECTIFIER
Ports: GND(pwr) ZEROCROSS(out) 3V3(pwr) N1(pwr) N2(pwr) VDC(pwr) BAT(pwr) SCL(in) SDA(io) !LED_RESET!(in)
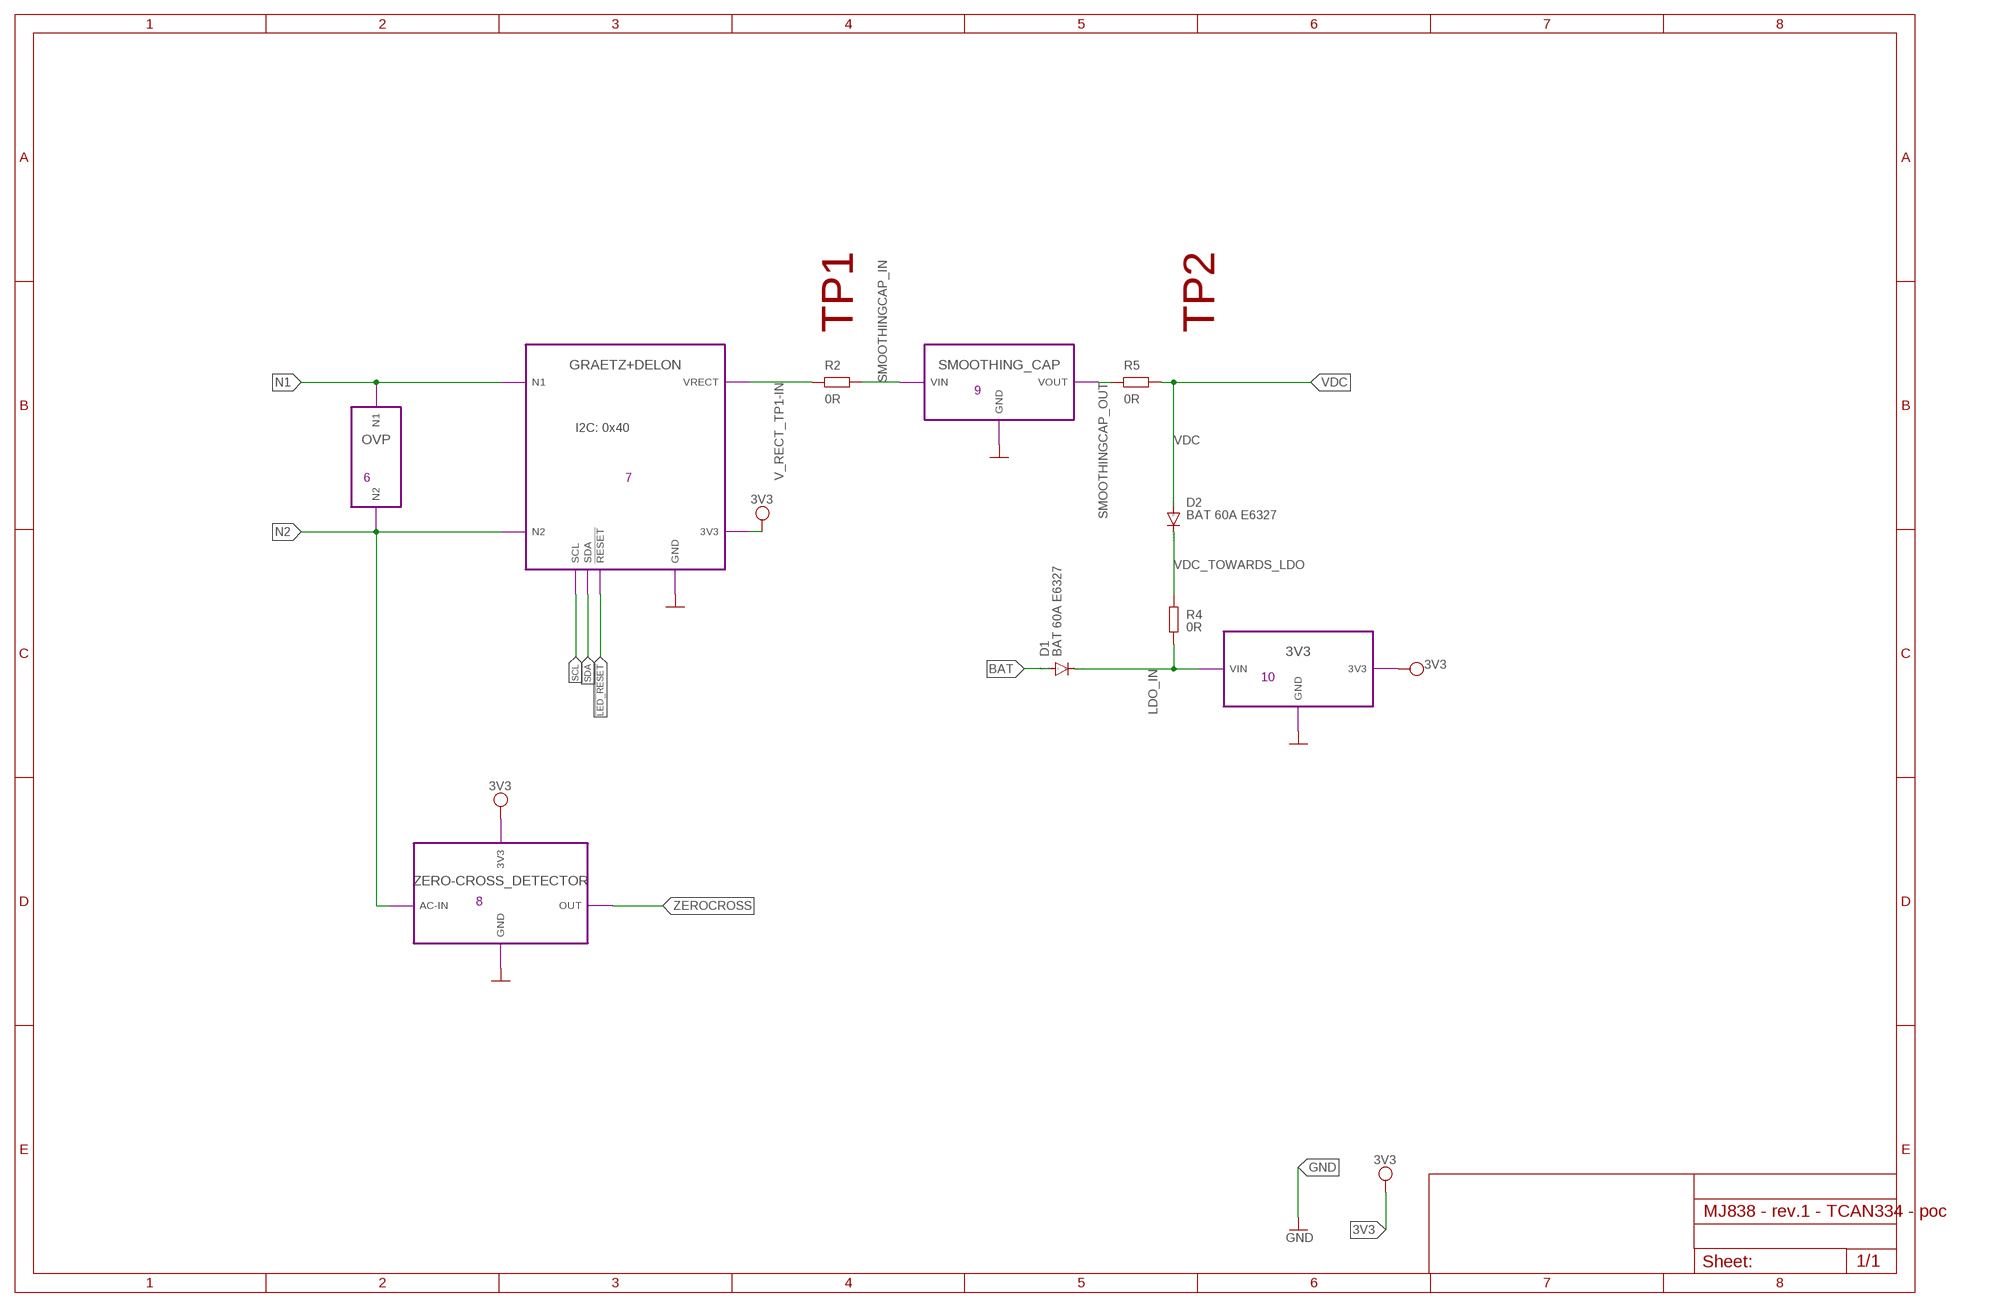
[diagram p13: schematic, module RECTIFIER, sheet 1]

### Parts
D1  BAT 60A E6327  DIODE-SOD323-W  [SOD323-W]
D2  BAT 60A E6327  DIODE-SOD323-W  [SOD323-W]
R2  0R  R-EU_R0805  [R0805]
R4  0R  R-EU_R0805  [R0805]
R5  0R  R-EU_R0805  [R0805]

### Module instances
OVP = OVP
ZERO-CROSS_DETECTOR = ZERO-CROSS_DETECTOR
3V3 = 3V3
SMOOTHING_CAP = SMOOTHING_CAP
GRAETZ+DELON = GRAETZ+DELON

### Nets
3V3 [3V3]: port ZERO-CROSS_DETECTOR.3V3 3V3.3V3 GRAETZ+DELON.3V3
!LED_RESET! [signal]: port GRAETZ+DELON.!RESET!
BAT [BAT+]: D1.A
GND: port ZERO-CROSS_DETECTOR.GND 3V3.GND SMOOTHING_CAP.GND GRAETZ+DELON.GND
LDO_IN [BAT+]: D1.C R4.2 ; port 3V3.VIN
N1 [VDynamo]: port OVP.N1 GRAETZ+DELON.N1
N2 [VDynamo]: port OVP.N2 ZERO-CROSS_DETECTOR.AC-IN GRAETZ+DELON.N2
SCL [signal]: port GRAETZ+DELON.SCL
SDA [signal]: port GRAETZ+DELON.SDA
SMOOTHINGCAP_IN [VAC]: R2.2 ; port SMOOTHING_CAP.VIN
SMOOTHINGCAP_OUT [VDC]: R5.1 ; port SMOOTHING_CAP.VOUT
V_RECT_TP1-IN [VAC]: R2.1 ; port GRAETZ+DELON.VRECT
VDC [VDC]: D2.A R5.2
VDC_TOWARDS_LDO [BAT+]: D2.C R4.1
ZEROCROSS [signal]: port ZERO-CROSS_DETECTOR.OUT

### Notes on the sheet
- TP1 | TP2
- 9
- I2C: 0x40
- 6 | 7
- 10
- 8

### Library data of the parts
D1 D2 = diode:DIODE-: DIODE
R2 R4 R5 = rcl:R-EU_: RESISTOR, European symbol; SPICEPREFIX: R

## Module ARTIFICIAL_LOAD
Ports: GND(pwr) IN(pwr) !CTRL!(in)
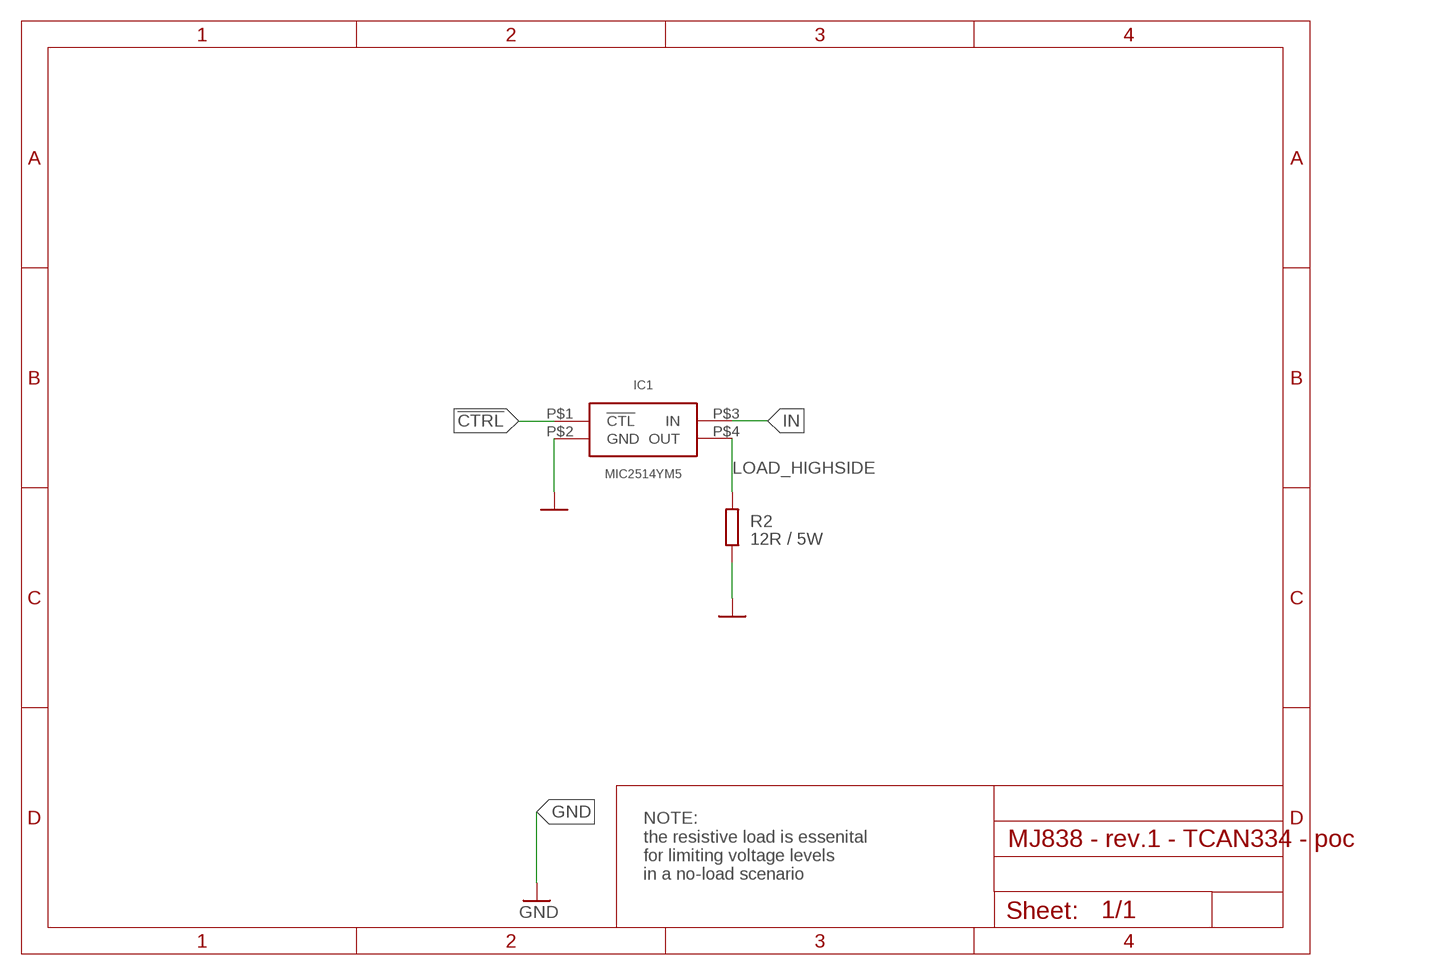
[diagram p14: schematic, module ARTIFICIAL_LOAD, sheet 1]

### Parts
IC1  MIC2514YM5  MIC2514  [SOT-23-5]
R2  12R / 5W  R-EU_R2512  [R2512]

### Nets
!CTRL! [signal]: IC1.P$1(!CTL!)
GND: IC1.P$2(GND) R2.1
IN [VDC]: IC1.P$3(IN)
LOAD_HIGHSIDE [VDC]: IC1.P$4(OUT) R2.2

### Notes on the sheet
- NOTE:
  the resistive load is essenital 
  for limiting voltage levels
  in a no-load scenario

### Library data of the parts
IC1 = MIC2514 - High-Side load switch:MIC2514
R2 = rcl:R-EU_: RESISTOR, European symbol; SPICEPREFIX: R

## Module FE-RAM
Ports: GND(pwr) 3V3(pwr) I2C_SCL(in) I2C_SDA(io) WP(hiz)
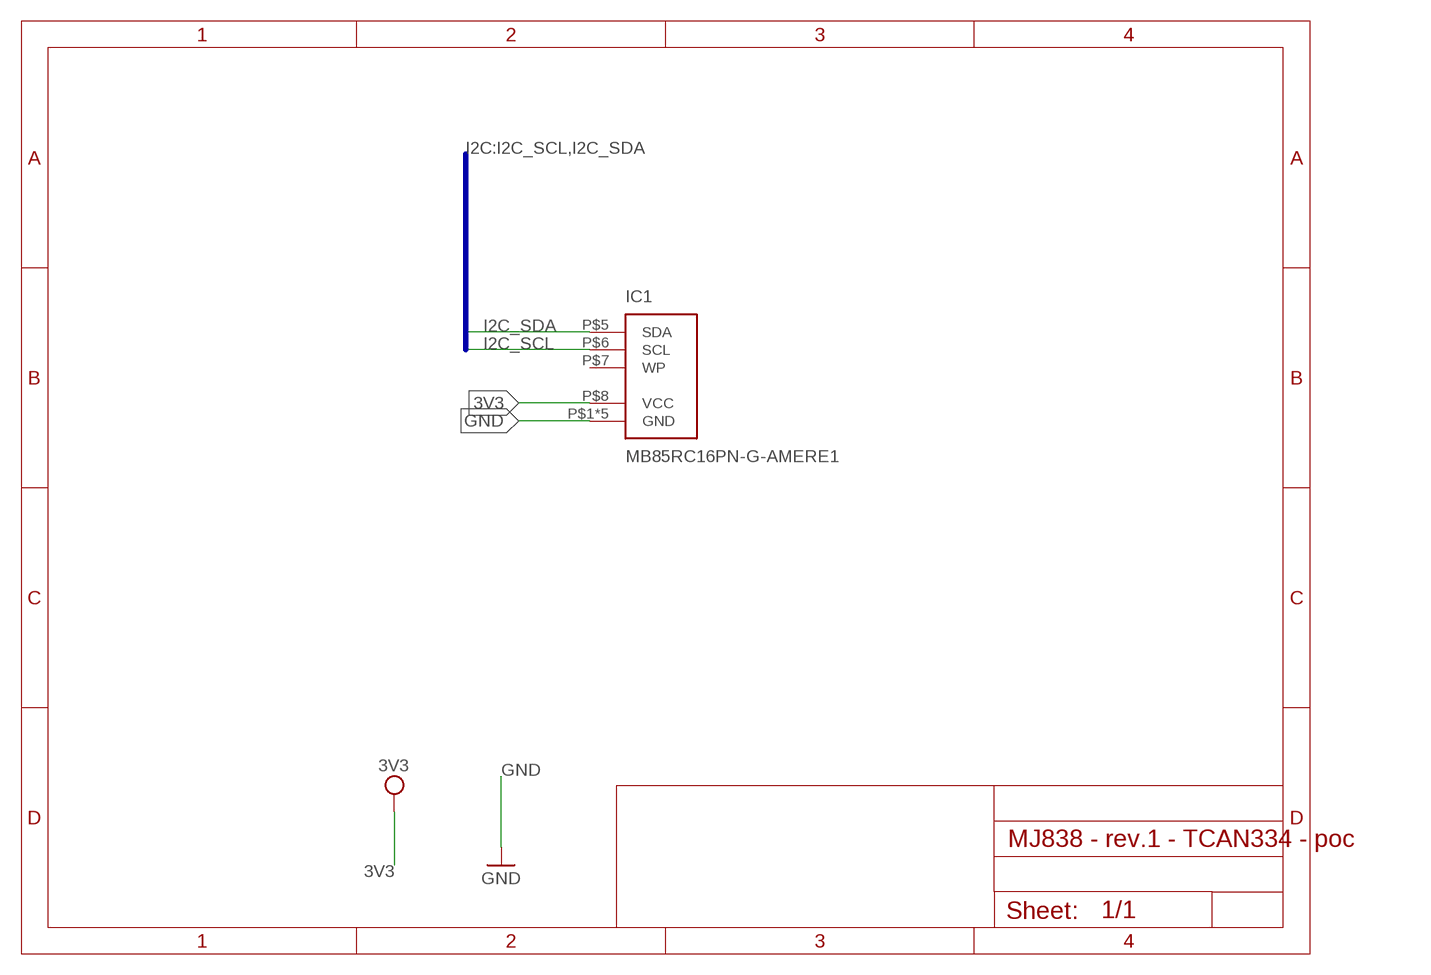
[diagram p15: schematic, module FE-RAM, sheet 1]

### Parts
IC1  MB85RC16PN-G-AMERE1  MB85RC  [SON-8]

### Nets
3V3 [3V3]: IC1.P$8(VCC)
GND: IC1.P$1(GND) IC1.P$2(GND) IC1.P$3(GND) IC1.P$4(GND) IC1.P$9(GND)
I2C_SCL [signal]: IC1.P$6(SCL)
I2C_SDA [signal]: IC1.P$5(SDA)
Unconnected: IC1.P$7(WP)

### Buses
I2C:I2C_SCL,I2C_SDA

### Library data of the parts
IC1 = MB85RC - FeRAM, I2C:MB85RC

## Module POWER_MONITOR
Ports: GND(pwr) 3V3(pwr) SCL(in) SDA(io) !PWRDN!(in) !ALERT1!(io) !ALERT2!(io) VBUS1+(hiz) VBUS2+(hiz) SENSE1+(hiz) SENSE1-(hiz) SEMSE2+(hiz) SENSE2-(hiz)
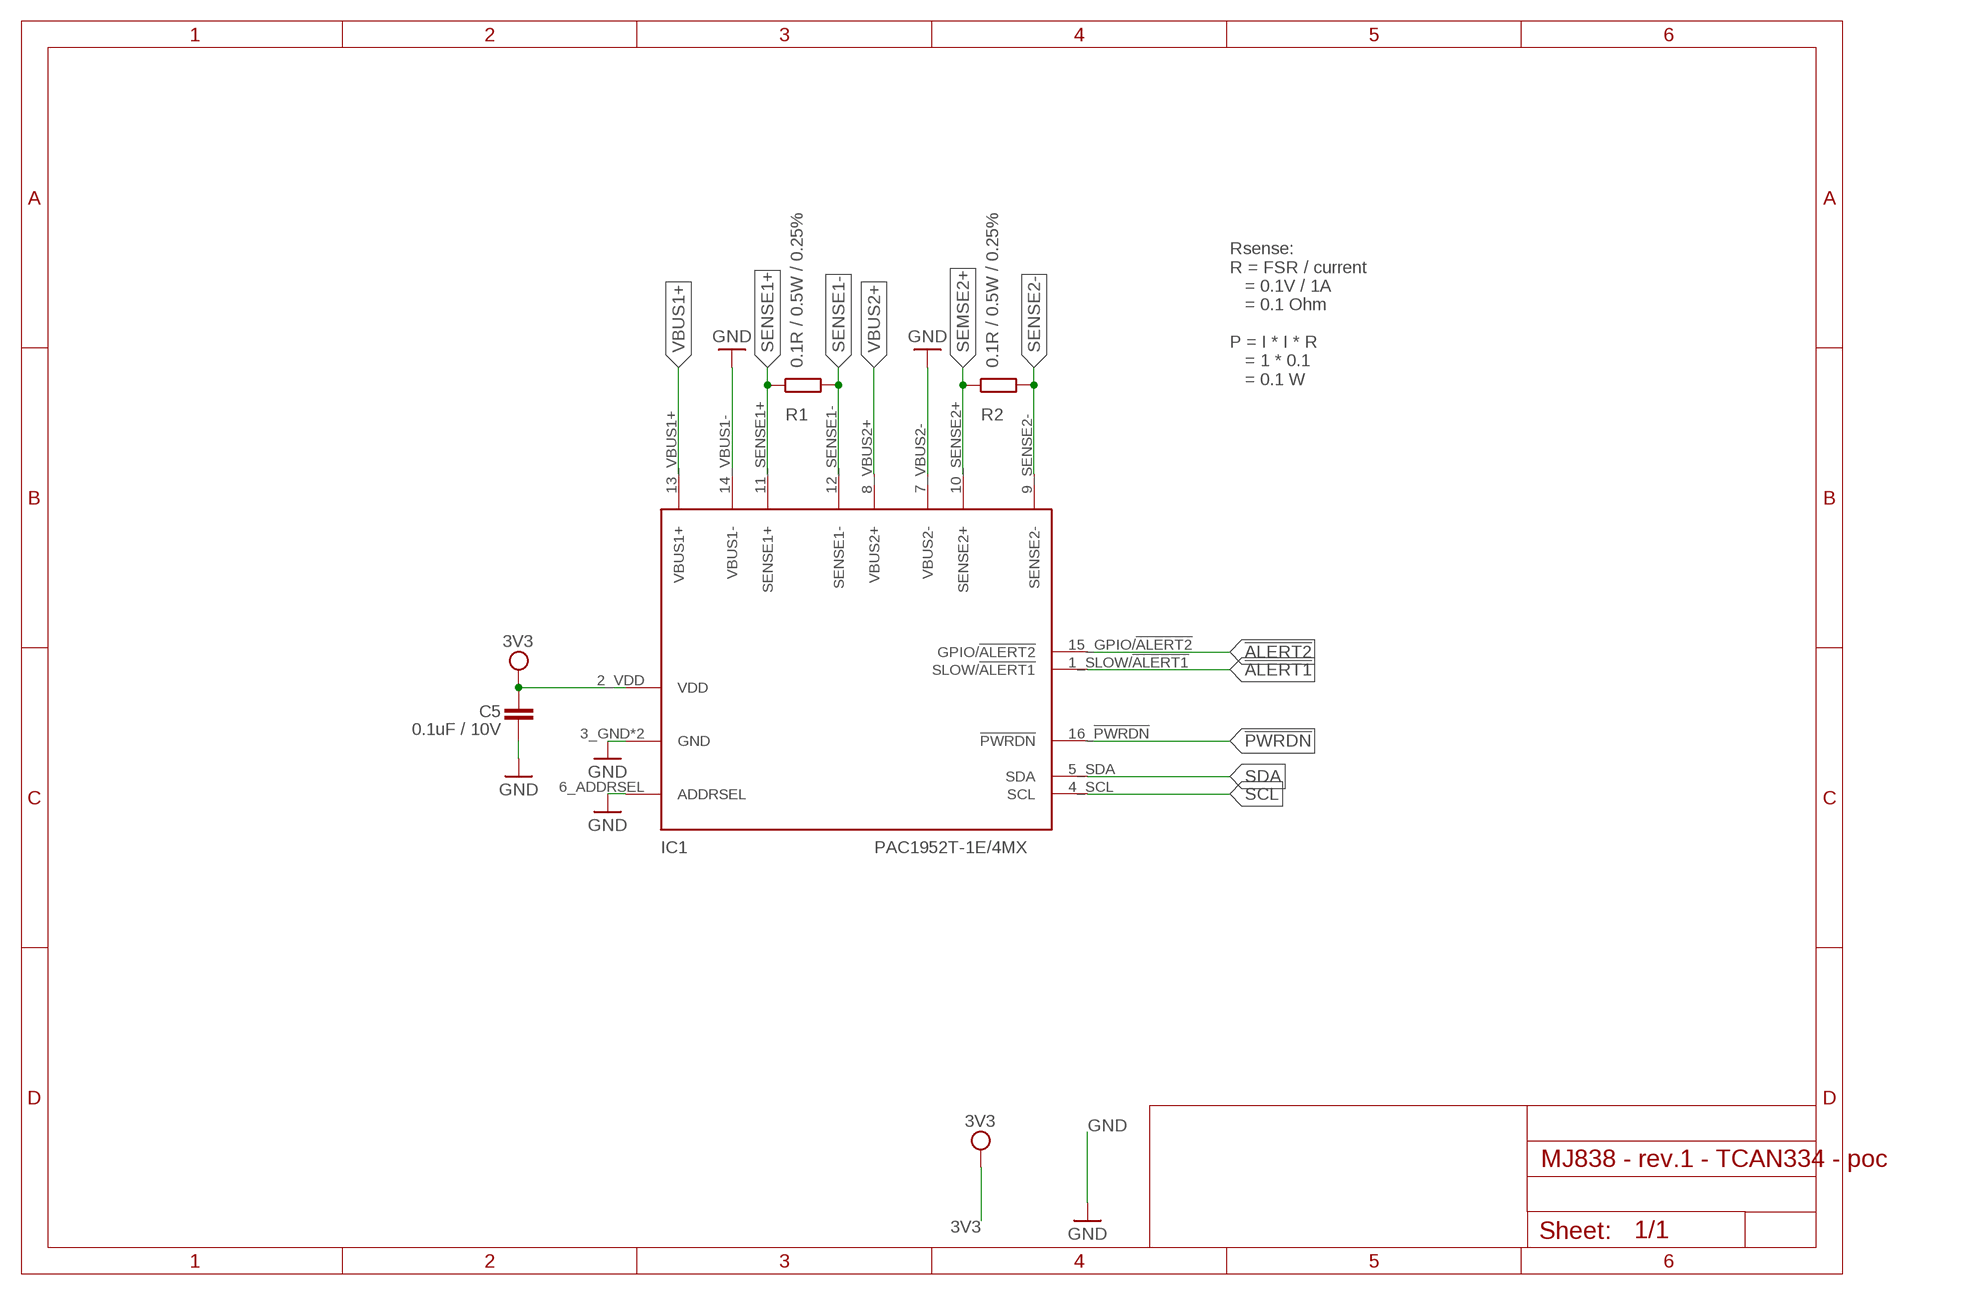
[diagram p16: schematic, module POWER_MONITOR, sheet 1]

### Parts
C5  0.1uF / 10V  C-EUC0402  [C0402]
IC1  PAC1952T-1E/4MX  PAC1952-2  [VQFN16]
R1  0.1R / 0.5W / 0.25%  R-EU_R1206  [R1206]
R2  0.1R / 0.5W / 0.25%  R-EU_R1206  [R1206]

### Nets
3V3 [3V3]: C5.1 IC1.2_VDD(VDD)
!ALERT1! [signal]: IC1.1_SLOW/!ALERT1!(SLOW/!ALERT1!)
!ALERT2! [signal]: IC1.15_GPIO/!ALERT2!(GPIO/!ALERT2!)
!PWRDN! [signal]: IC1.16_!PWRDN!(!PWRDN!)
GND: C5.2 IC1.3_GND(GND) IC1.6_ADDRSEL(ADDRSEL) IC1.7_VBUS2-(VBUS2-) IC1.14_VBUS1-(VBUS1-) IC1.17_GND(GND)
SCL [signal]: IC1.4_SCL(SCL)
SDA [signal]: IC1.5_SDA(SDA)
SEMSE2+: IC1.10_SENSE2+(SENSE2+) R2.1
SENSE1+: IC1.11_SENSE1+(SENSE1+) R1.1
SENSE1-: IC1.12_SENSE1-(SENSE1-) R1.2
SENSE2-: IC1.9_SENSE2-(SENSE2-) R2.2
VBUS1+: IC1.13_VBUS1+(VBUS1+)
VBUS2+: IC1.8_VBUS2+(VBUS2+)

### Notes on the sheet
- Rsense:
  R = FSR / current
     = 0.1V / 1A
     = 0.1 Ohm
  
  P = I * I * R
     = 1 * 0.1 
     = 0.1 W

### Library data of the parts
C5 = rcl:C-EU: CAPACITOR, European symbol; SPICEPREFIX: C
IC1 = PAC1954 - Power Monitor:PAC1952-2
R1 R2 = rcl:R-EU_: RESISTOR, European symbol; SPICEPREFIX: R

## Module HUMIDITY
Ports: GND(pwr) 3V3(pwr) SCL(in) SDA(io)
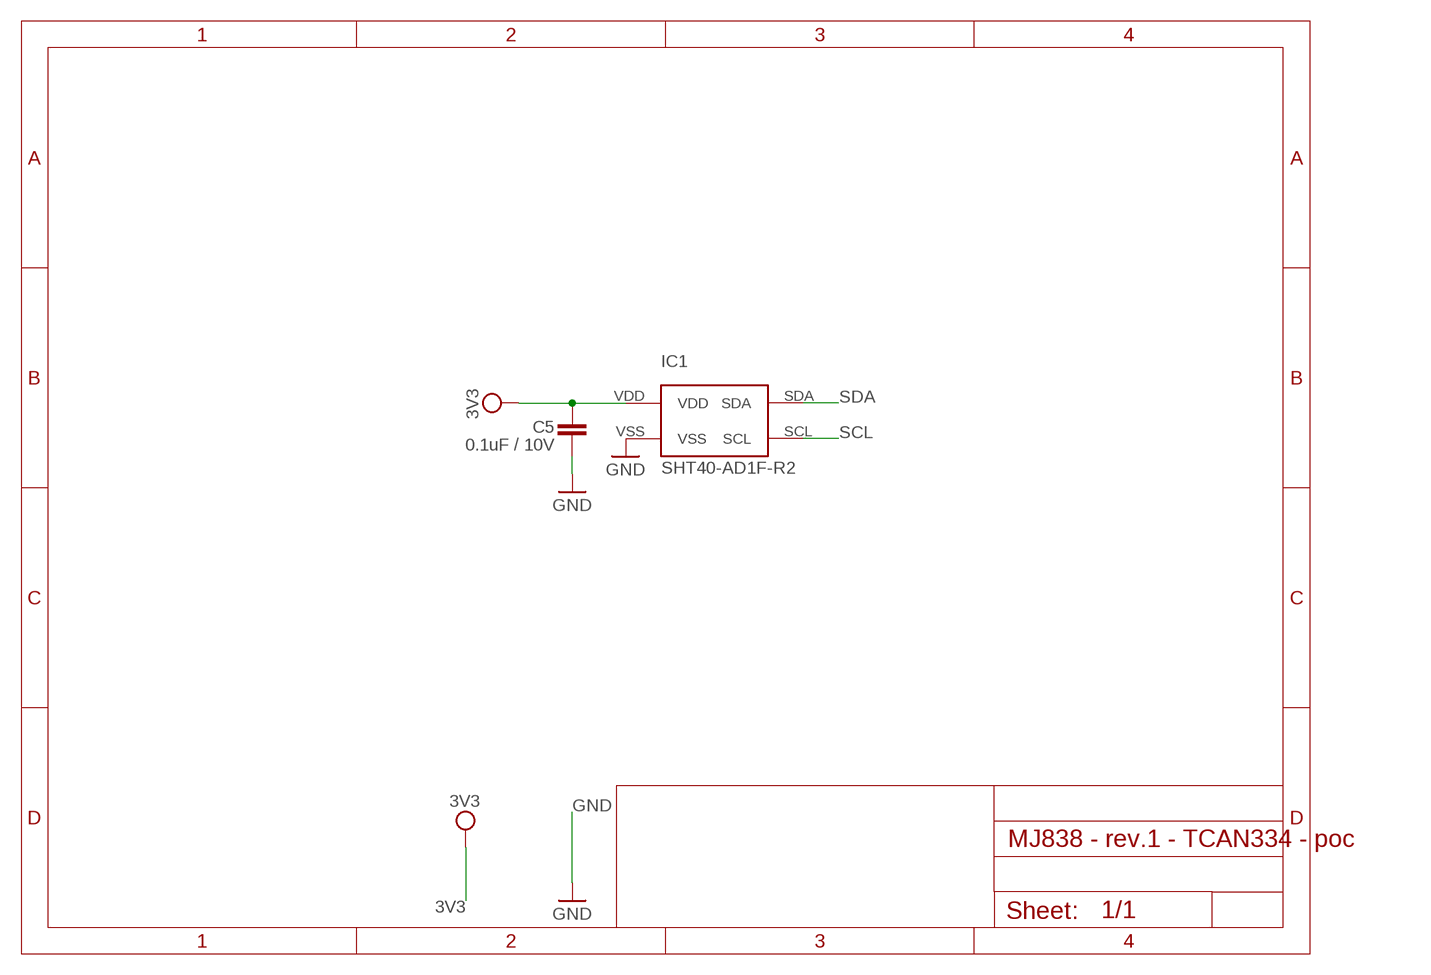
[diagram p17: schematic, module HUMIDITY, sheet 1]

### Parts
C5  0.1uF / 10V  C-EUC0402  [C0402]
IC1  SHT40-AD1F-R2  SHT40  [SMD]

### Nets
3V3 [3V3]: C5.1 IC1.VDD
GND: C5.2 IC1.VSS
SCL [signal]: IC1.SCL
SDA [signal]: IC1.SDA

### Library data of the parts
C5 = rcl:C-EU: CAPACITOR, European symbol; SPICEPREFIX: C
IC1 = SHT40-AD1F - Humidity Sensor:SHT40

## Net classes
0 GND: width 0.25 mm, drill 0.35 mm, clearance 0.19 mm
1 BAT+: width 0.5 mm, drill 0.5 mm, clearance 0.5 mm to class 0, clearance 0.5 mm
2 signal: width 0.25 mm, drill 0.35 mm, clearance 0.19 mm to class 0, clearance 0.19 mm to class 1, clearance 0.19 mm
3 3V3: width 0.25 mm, drill 0.35 mm, clearance 0.19 mm to class 0, clearance 0.19 mm to class 1, clearance 0.19 mm to class 2, clearance 0.19 mm
4 VDC: width 0.5 mm, drill 0.35 mm, clearance 0.5 mm to class 0, clearance 0.5 mm to class 1, clearance 0.5 mm to class 2, clearance 0.5 mm to class 3, clearance 0.5 mm
5 VDynamo: width 0.5 mm, drill 0.35 mm, clearance 0.5 mm to class 0, clearance 0.5 mm to class 1, clearance 0.5 mm to class 2, clearance 0.5 mm to class 3, clearance 0.5 mm to class 4, clearance 0.5 mm
6 VAC: width 0.5 mm, drill 0.35 mm, clearance 0.5 mm to class 0, clearance 0.5 mm to class 1, clearance 0.5 mm to class 2, clearance 0.5 mm to class 3, clearance 0.5 mm to class 4, clearance 0.5 mm to class 5, clearance 0.5 mm